# EAGLE design CTD_V02 (EAGLE 9.4.0)

## Sheet 1 of 4
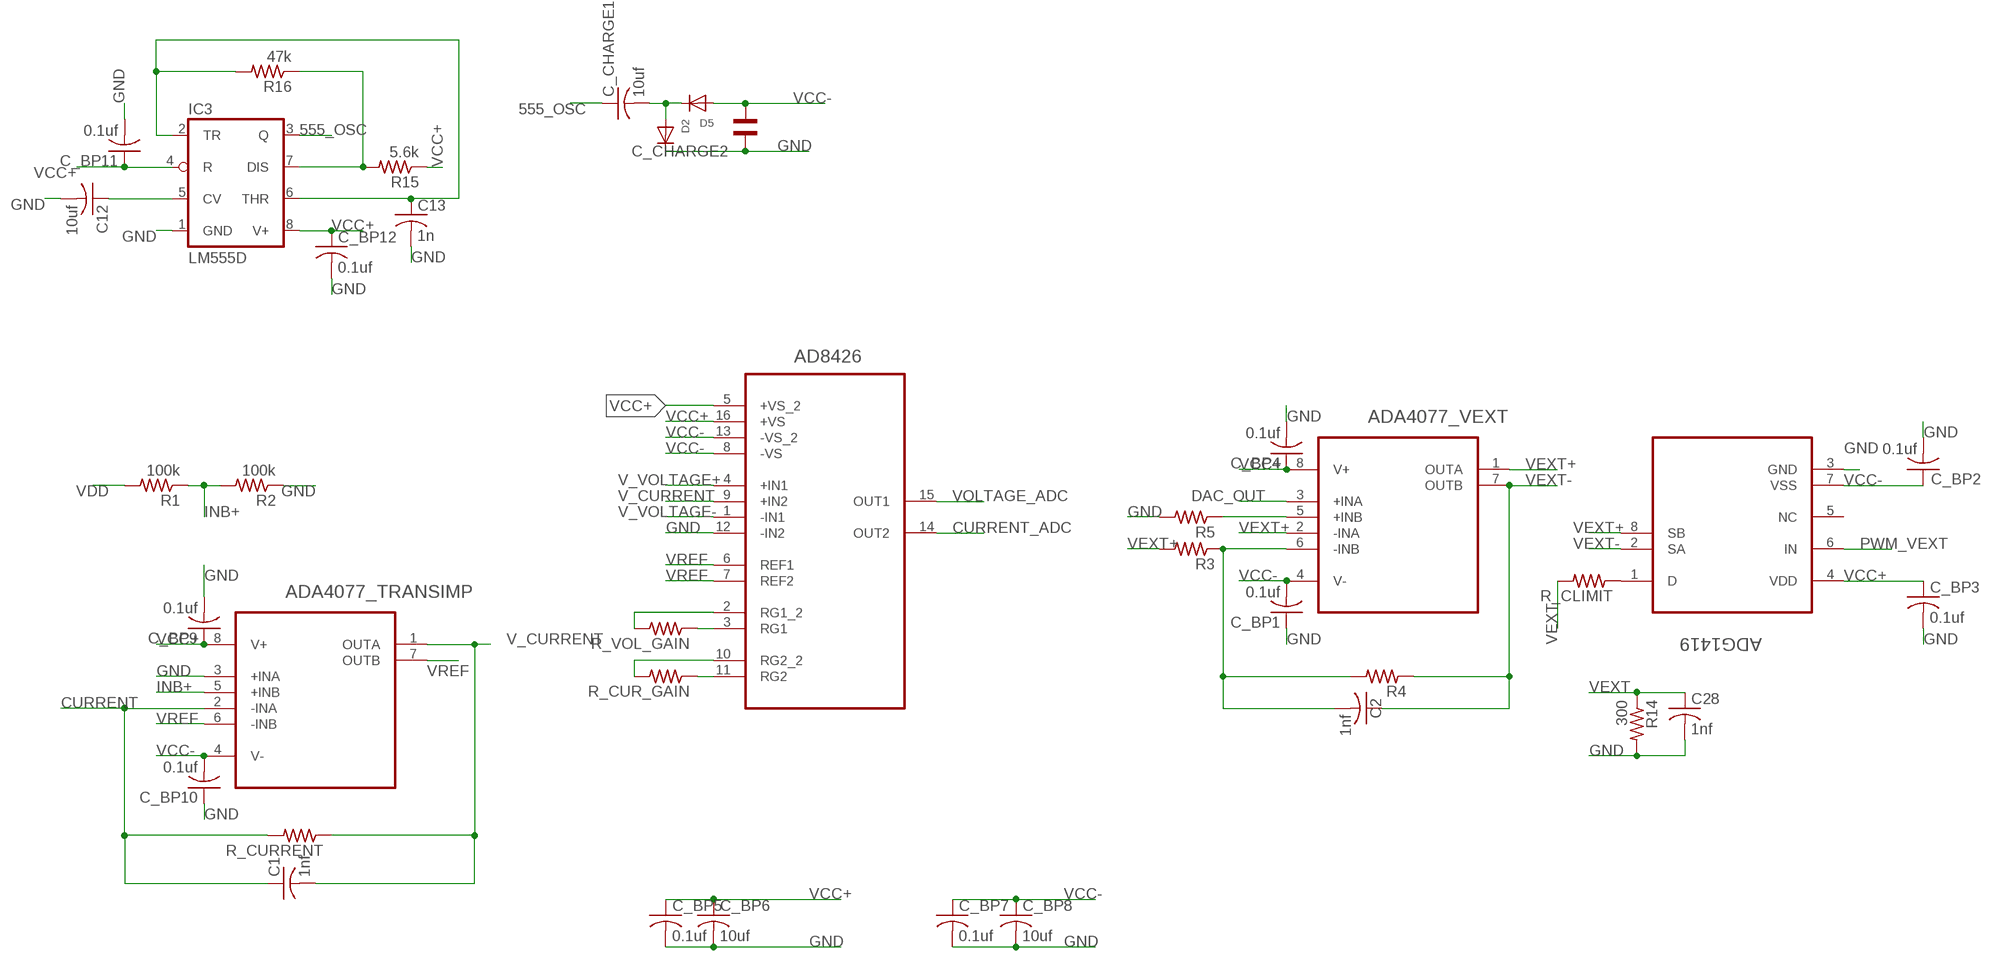
[diagram p0: schematic, sheet 1]

### Parts
AD8426  AD8426BCPZ-WP  [QFN65P400X400X100-16N]
ADA4077_TRANSIMP  ADA4075-2ARZ  [SOIC127P600X175-8N]
ADA4077_VEXT  ADA4075-2ARZ  [SOIC127P600X175-8N]
ADG1419  ADG1419BRMZ  [SOP65P490X110-8N]
C1  1nf  C-USC0603  [C0603]
C2  1nf  C-USC0603  [C0603]
C12  10uf  C-USC0603  [C0603]
C13  1n  C-USC0603  [C0603]
C28  1nf  C-USC0603  [C0603]
C_BP1  0.1uf  C-USC0603  [C0603]
C_BP2  0.1uf  C-USC0603  [C0603]
C_BP3  0.1uf  C-USC0603  [C0603]
C_BP4  0.1uf  C-USC0603  [C0603]
C_BP5  0.1uf  C-USC0603  [C0603]
C_BP6  10uf  C-USC0603  [C0603]
C_BP7  0.1uf  C-USC0603  [C0603]
C_BP8  10uf  C-USC0603  [C0603]
C_BP9  0.1uf  C-USC0603  [C0603]
C_BP10  0.1uf  C-USC0603  [C0603]
C_BP11  0.1uf  C-USC0603  [C0603]
C_BP12  0.1uf  C-USC0603  [C0603]
C_CHARGE1  10uf  C-USC0603  [C0603]
C_CHARGE2  WCAP-CSGP_1206_885012008001  [WCAP-CSGP_1206]
D2  DIODESOD-123  [SOD-123]
D5  DIODESOD-123  [SOD-123]
IC3  LM555D  [SO08]
R1  100k  R-US_R0603  [R0603]
R2  100k  R-US_R0603  [R0603]
R3  R-US_R0603  [R0603]
R4  R-US_R0603  [R0603]
R5  R-US_R0603  [R0603]
R14  300  R-US_R0603  [R0603]
R15  5.6k  R-US_R0603  [R0603]
R16  47k  R-US_R0603  [R0603]
R_CLIMIT  R-US_R0603  [R0603]
R_CUR_GAIN  R-US_R0603  [R0603]
R_CURRENT  R-US_R0603  [R0603]
R_VOL_GAIN  R-US_R0603  [R0603]

### Nets
555_OSC: C_CHARGE1.1 IC3.3(Q)
CURRENT: ADA4077_TRANSIMP.2(-INA) C1.1 R_CURRENT.2 ; also sheet 2
CURRENT_ADC: AD8426.14(OUT2) ; also sheet 2
DAC_OUT: ADA4077_VEXT.3(+INA) ; also sheet 2
GND: AD8426.12(-IN2) ADA4077_TRANSIMP.3(+INA) ADG1419.3(GND) C12.2 C13.2 C28.2 C_BP1.1 C_BP2.2 C_BP3.2 C_BP4.2 C_BP5.2 C_BP6.2 C_BP7.2 C_BP8.2 C_BP9.2 C_BP10.1 C_BP11.2 C_BP12.2 C_CHARGE2.2 D2.C IC3.1(GND) R2.1 R5.2 R14.2 ; also sheet 2,3,4
INB+: ADA4077_TRANSIMP.5(+INB) R1.1 R2.2
N$2: AD8426.2(RG1_2) R_VOL_GAIN.2
N$3: AD8426.3(RG1) R_VOL_GAIN.1
N$4: AD8426.10(RG2_2) R_CUR_GAIN.2
N$5: ADA4077_VEXT.5(+INB) R5.1
N$6: AD8426.11(RG2) R_CUR_GAIN.1
N$7: ADA4077_VEXT.6(-INB) C2.2 R3.1 R4.2
N$9: IC3.7(DIS) R15.2 R16.1
N$11: C12.1 IC3.5(CV)
N$16: ADG1419.1(D) R_CLIMIT.1
N$17: C_CHARGE1.2 D2.A D5.C
N$18: C13.1 IC3.2(TR) IC3.6(THR) R16.2
PWM_VEXT: ADG1419.6(IN) ; also sheet 2
V_CURRENT: AD8426.9(+IN2) ADA4077_TRANSIMP.1(OUTA) C1.2 R_CURRENT.1
V_VOLTAGE+: AD8426.4(+IN1) ; also sheet 2
V_VOLTAGE-: AD8426.1(-IN1) ; also sheet 2
VCC+: AD8426.5(+VS_2) AD8426.16(+VS) ADA4077_TRANSIMP.8(V+) ADA4077_VEXT.8(V+) ADG1419.4(VDD) C_BP3.1 C_BP4.1 C_BP5.1 C_BP6.1 C_BP9.1 C_BP11.1 C_BP12.1 IC3.4(R) IC3.8(V+) R15.1 ; also sheet 2,3,4
VCC-: AD8426.8(-VS) AD8426.13(-VS_2) ADA4077_TRANSIMP.4(V-) ADA4077_VEXT.4(V-) ADG1419.7(VSS) C_BP1.2 C_BP2.1 C_BP7.1 C_BP8.1 C_BP10.2 C_CHARGE2.1 D5.A
VDD: R1.2 ; also sheet 2,3,4
VEXT: C28.1 R14.1 R_CLIMIT.2 ; also sheet 2
VEXT+: ADA4077_VEXT.1(OUTA) ADA4077_VEXT.2(-INA) ADG1419.8(SB) R3.2
VEXT-: ADA4077_VEXT.7(OUTB) ADG1419.2(SA) C2.1 R4.1
VOLTAGE_ADC: AD8426.15(OUT1) ; also sheet 2
VREF: AD8426.6(REF1) AD8426.7(REF2) ADA4077_TRANSIMP.6(-INB) ADA4077_TRANSIMP.7(OUTB)
Unconnected: ADG1419.5(NC)

## Sheet 2 of 4
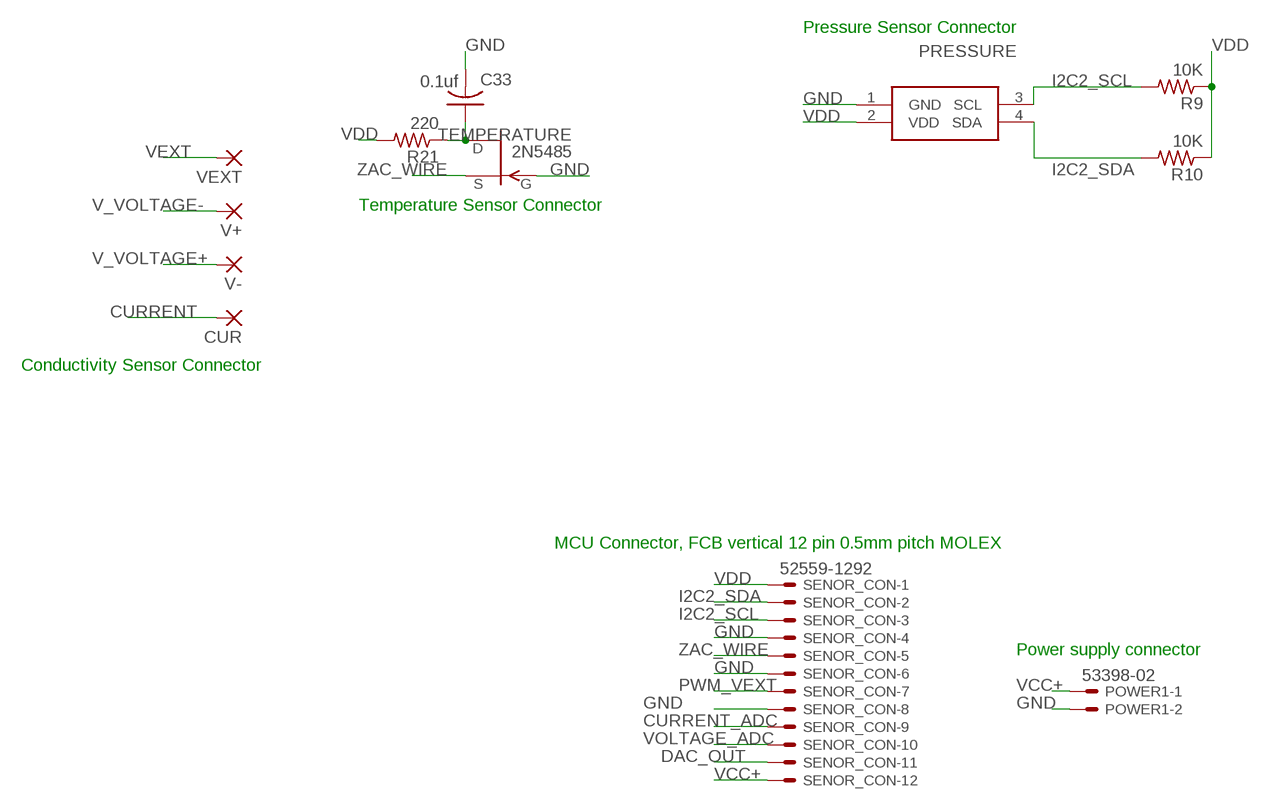
[diagram p1: schematic, sheet 2]

### Parts
C33  0.1uf  C-USC0603  [C0603]
CUR  SMD2  [SMD1,27-2,54]
POWER1  53398-02  [53398-02]
PRESSURE  MS583702BA01-50  [MS583702BA0150]
R9  10K  R-US_R0603  [R0603]
R10  10K  R-US_R0603  [R0603]
R21  220  R-US_R0603  [R0603]
SENOR_CON  52559-1292  [52559-1292]
TEMPERATURE  2N5485  [TO92-]
V+  SMD2  [SMD1,27-2,54]
V-  SMD2  [SMD1,27-2,54]
VEXT  SMD2  [SMD1,27-2,54]

### Nets
CURRENT: CUR.1(P) ; also sheet 1
CURRENT_ADC: SENOR_CON.9 ; also sheet 1
DAC_OUT: SENOR_CON.11 ; also sheet 1
GND: C33.2 POWER1.2 PRESSURE.1(GND) SENOR_CON.4 SENOR_CON.6 SENOR_CON.8 TEMPERATURE.1(G) ; also sheet 1,3,4
I2C2_SCL: PRESSURE.3(SCL) R9.2 SENOR_CON.3
I2C2_SDA: PRESSURE.4(SDA) R10.2 SENOR_CON.2
N$8: C33.1 R21.1 TEMPERATURE.3(D)
PWM_VEXT: SENOR_CON.7 ; also sheet 1
V_VOLTAGE+: V-.1(P) ; also sheet 1
V_VOLTAGE-: V+.1(P) ; also sheet 1
VCC+: POWER1.1 SENOR_CON.12 ; also sheet 1,3,4
VDD: PRESSURE.2(VDD) R9.1 R10.1 R21.2 SENOR_CON.1 ; also sheet 1,3,4
VEXT: VEXT.1(P) ; also sheet 1
VOLTAGE_ADC: SENOR_CON.10 ; also sheet 1
ZAC_WIRE: SENOR_CON.5 TEMPERATURE.2(S)

### Notes on the sheet
- Pressure Sensor Connector
- Temperature Sensor Connector
- Conductivity Sensor Connector
- MCU Connector, FCB vertical 12 pin 0.5mm pitch MOLEX
- Power supply connector

## Sheet 3 of 4
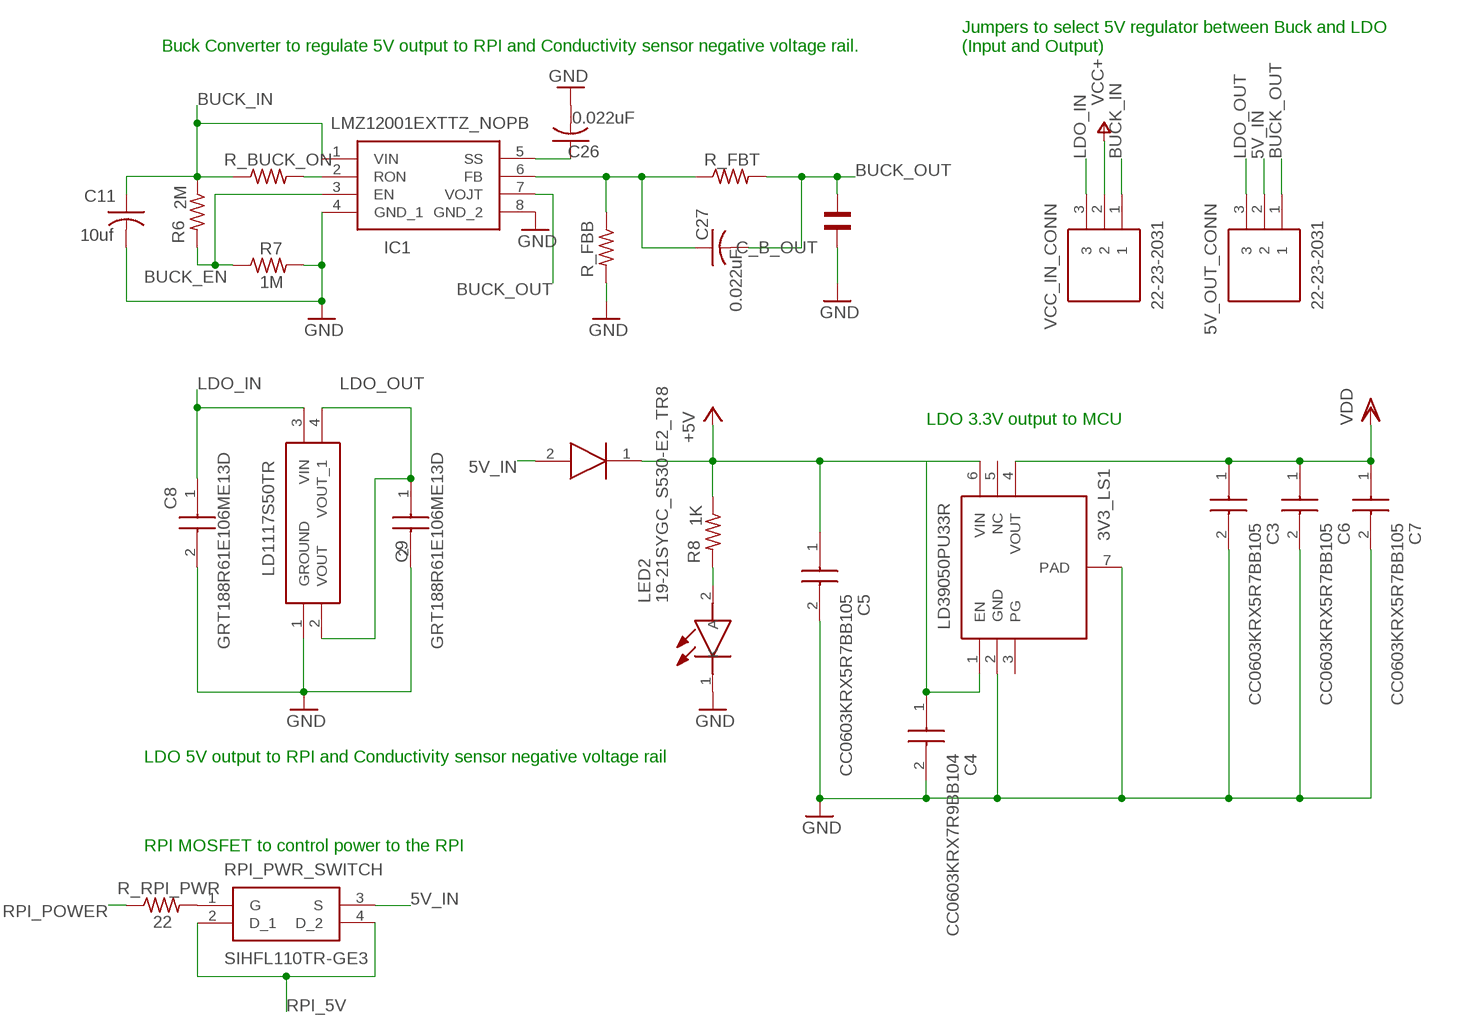
[diagram p2: schematic, sheet 3]

### Parts
3V3_LS1  LD39050PU33R  [SON95P300X300X100-7N]
5V_LS1  LD1117S50TR  [SOT230P700X190-4N]
5V_OUT_CONN  22-23-2031  [SHDR3W87P0X254_1X3_747X635X843]
C3  CC0603KRX5R7BB105  [CAPC1608X90N]
C4  CC0603KRX7R9BB104  [CAPC1608X90N]
C5  CC0603KRX5R7BB105  [CAPC1608X90N]
C6  CC0603KRX5R7BB105  [CAPC1608X90N]
C7  CC0603KRX5R7BB105  [CAPC1608X90N]
C8  GRT188R61E106ME13D  [CAPC1608X100N]
C9  GRT188R61E106ME13D  [CAPC1608X100N]
C11  10uf  C-USC0603  [C0603]
C26  0.022uF  C-USC0603  [C0603]
C27  0.022uF  C-USC0603  [C0603]
C_B_OUT  WCAP-CSGP_1206_885012008001  [WCAP-CSGP_1206]
D3  STPS2L30A  [DIOM5126X265N]
IC1  LMZ12001EXTTZ_NOPB  [NDW0007A]
LED2  19-21SYGC_S530-E2_TR8  [LEDC1608X90N]
R6  2M  R-US_R0603  [R0603]
R7  1M  R-US_R0603  [R0603]
R8  1K  R-US_R0603  [R0603]
R_BUCK_ON  R-US_R0603  [R0603]
R_FBB  R-US_R0603  [R0603]
R_FBT  R-US_R0603  [R0603]
R_RPI_PWR  22  R-US_R0603  [R0603]
RPI_PWR_SWITCH  SIHFL110TR-GE3  [SOT230P700X180-4N]
VCC_IN_CONN  22-23-2031  [SHDR3W87P0X254_1X3_747X635X843]

### Nets
5V_IN: 5V_OUT_CONN.2 D3.2(A) RPI_PWR_SWITCH.3(S) ; also sheet 4
+5V: 3V3_LS1.1(EN) 3V3_LS1.6(VIN) C4.1 C5.1 D3.1(K) R8.1
BUCK_EN: IC1.3(EN) R6.2 R7.1
BUCK_IN: C11.1 IC1.1(VIN) R6.1 R_BUCK_ON.1 VCC_IN_CONN.1
BUCK_OUT: 5V_OUT_CONN.1 C27.2 C_B_OUT.1 IC1.7(VOJT) R_FBT.2
GND: 3V3_LS1.2(GND) 3V3_LS1.7(PAD) 5V_LS1.1(GROUND) C3.2 C4.2 C5.2 C6.2 C7.2 C8.2 C9.2 C11.2 C26.2 C_B_OUT.2 IC1.4(GND_1) IC1.8(GND_2) LED2.1(K) R7.2 R_FBB.2 ; also sheet 1,2,4
LDO_IN: 5V_LS1.3(VIN) C8.1 VCC_IN_CONN.3
LDO_OUT: 5V_LS1.2(VOUT) 5V_LS1.4(VOUT_1) 5V_OUT_CONN.3 C9.1
N$1: C27.1 IC1.6(FB) R_FBB.1 R_FBT.1
N$10: C26.1 IC1.5(SS)
N$22: IC1.2(RON) R_BUCK_ON.2
N$23: LED2.2(A) R8.2
N$24: R_RPI_PWR.2 RPI_PWR_SWITCH.1(G)
RPI_5V: RPI_PWR_SWITCH.2(D_1) RPI_PWR_SWITCH.4(D_2) ; also sheet 4
RPI_POWER: R_RPI_PWR.1 ; also sheet 4
VCC+: VCC_IN_CONN.2 ; supply symbol labelled V+ ; also sheet 1,2,4
VDD: 3V3_LS1.4(VOUT) C3.1 C6.1 C7.1 ; also sheet 1,2,4
Unconnected: 3V3_LS1.3(PG) 3V3_LS1.5(NC)

### Notes on the sheet
- Buck Converter to regulate 5V output to RPI and Conductivity sensor negative voltage rail.
- Jumpers to select 5V regulator between Buck and LDO
  (Input and Output)
- LDO 3.3V output to MCU
- LDO 5V output to RPI and Conductivity sensor negative voltage rail
- RPI MOSFET to control power to the RPI

## Sheet 4 of 4
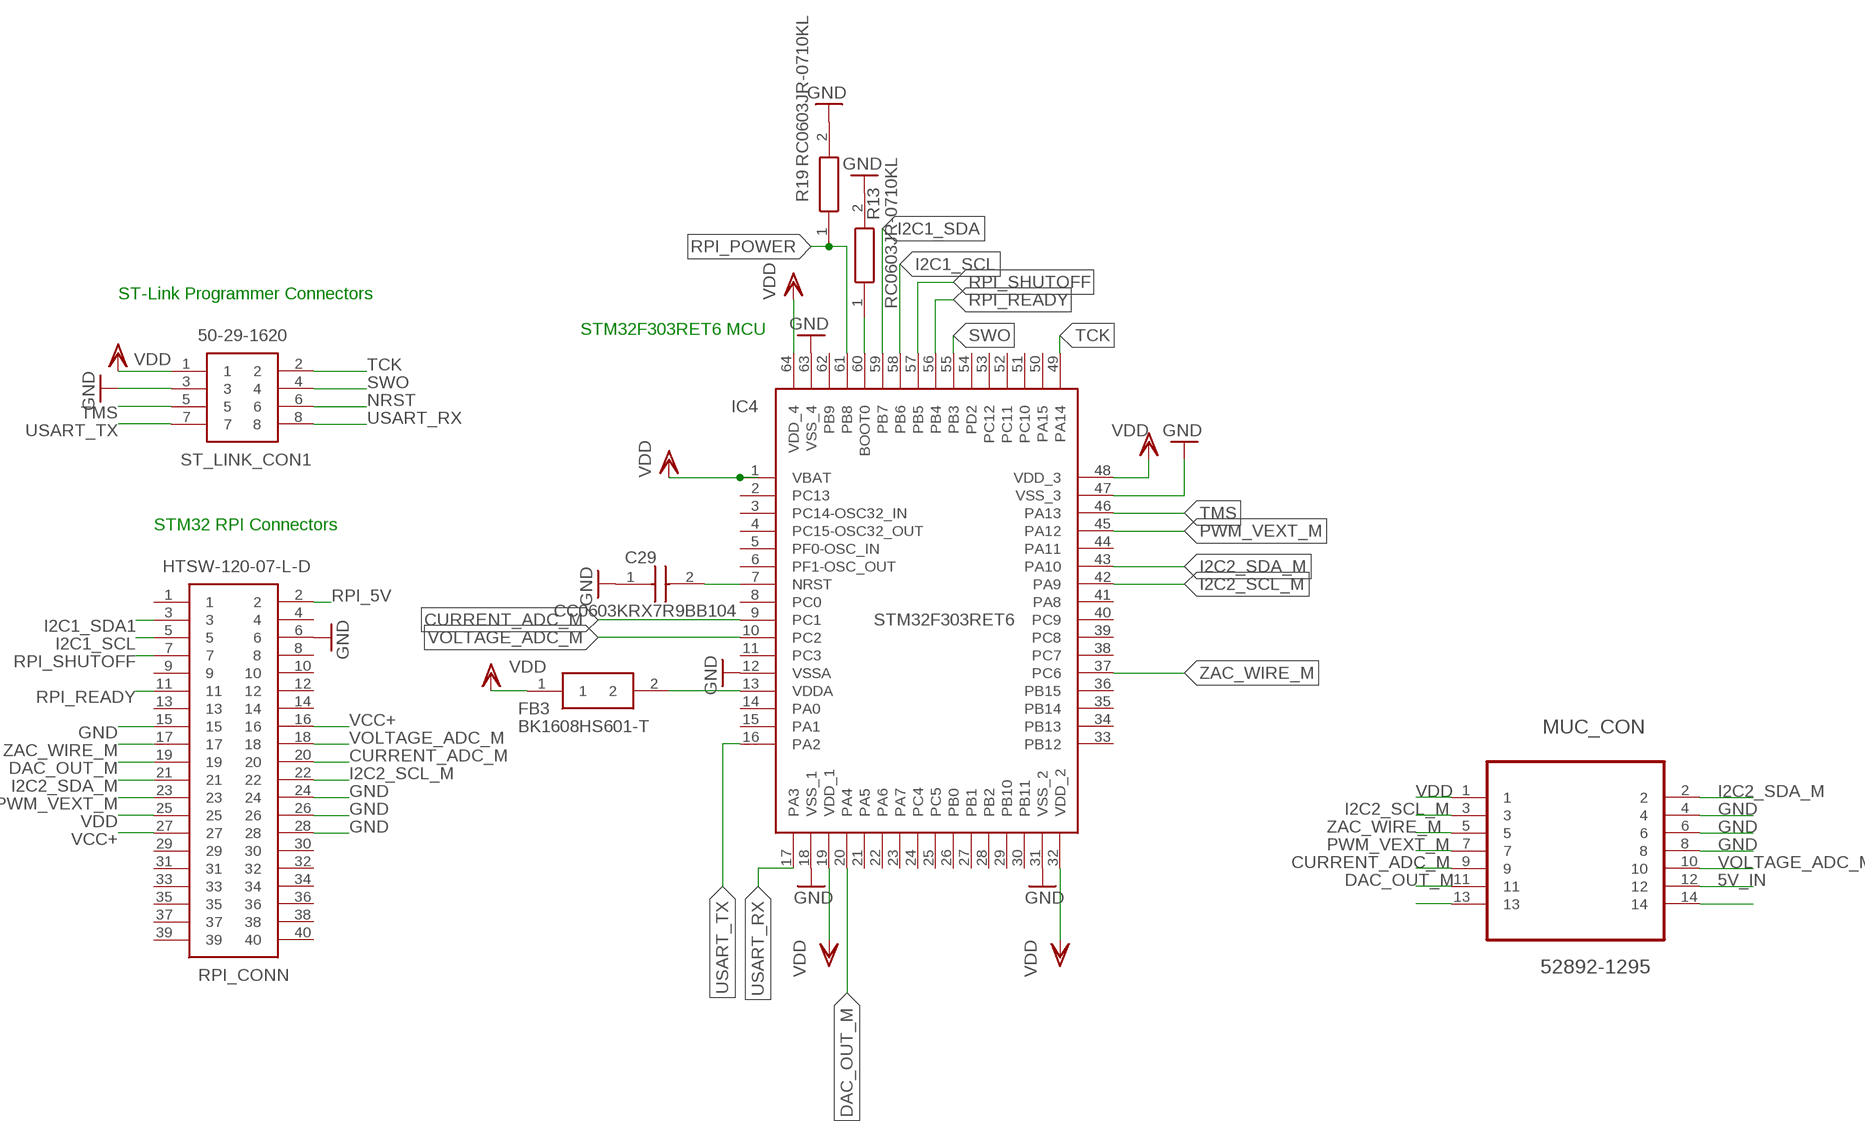
[diagram p3: schematic, sheet 4]

### Parts
C29  CC0603KRX7R9BB104  [CAPC1608X90N]
FB3  BK1608HS601-T  [BEADC1608X95N]
IC4  STM32F303RET6  [QFP50P1200X1200X160-64N]
MUC_CON  52892-1295  [MOLEX_52892-1295]
R13  RC0603JR-0710KL  [RESC1608X55N]
R19  RC0603JR-0710KL  [RESC1608X55N]
RPI_CONN  HTSW-120-07-L-D  [SAMTEC_HTSW-120-07-L]
ST_LINK_CON1  50-29-1620  [50291620]

### Nets
5V_IN: MUC_CON.12 ; also sheet 3
CURRENT_ADC_M: IC4.9(PC1) MUC_CON.9 RPI_CONN.20
DAC_OUT_M: IC4.20(PA4) MUC_CON.11 RPI_CONN.19
GND: C29.1 IC4.12(VSSA) IC4.18(VSS_1) IC4.31(VSS_2) IC4.47(VSS_3) IC4.63(VSS_4) MUC_CON.4 MUC_CON.6 MUC_CON.8 R13.2 R19.2 RPI_CONN.6 RPI_CONN.15 RPI_CONN.24 RPI_CONN.26 RPI_CONN.28 ST_LINK_CON1.3 ; also sheet 1,2,3
I2C1_SCL: IC4.58(PB6) RPI_CONN.5
I2C1_SDA: IC4.59(PB7)
I2C1_SDA1: RPI_CONN.3
I2C2_SCL_M: IC4.42(PA9) MUC_CON.3 RPI_CONN.22
I2C2_SDA_M: IC4.43(PA10) MUC_CON.2 RPI_CONN.21
N$21: MUC_CON.13
N$25: IC4.60(BOOT0) R13.1
N$27: FB3.2 IC4.13(VDDA)
N$33: MUC_CON.14
NRST: C29.2 IC4.7(NRST) ST_LINK_CON1.6
PWM_VEXT_M: IC4.45(PA12) MUC_CON.7 RPI_CONN.23
RPI_5V: RPI_CONN.2 ; also sheet 3
RPI_POWER: IC4.61(PB8) R19.1 ; also sheet 3
RPI_READY: IC4.56(PB4) RPI_CONN.11
RPI_SHUTOFF: IC4.57(PB5) RPI_CONN.7
SWO: IC4.55(PB3) ST_LINK_CON1.4
TCK: IC4.49(PA14) ST_LINK_CON1.2
TMS: IC4.46(PA13) ST_LINK_CON1.5
USART_RX: IC4.17(PA3) ST_LINK_CON1.8
USART_TX: IC4.16(PA2) ST_LINK_CON1.7
VCC+: RPI_CONN.16 RPI_CONN.27 ; also sheet 1,2,3
VDD: FB3.1 IC4.1(VBAT) IC4.19(VDD_1) IC4.32(VDD_2) IC4.48(VDD_3) IC4.64(VDD_4) MUC_CON.1 RPI_CONN.25 ST_LINK_CON1.1 ; also sheet 1,2,3
VOLTAGE_ADC_M: IC4.10(PC2) MUC_CON.10 RPI_CONN.18
ZAC_WIRE_M: IC4.37(PC6) MUC_CON.5 RPI_CONN.17
Unconnected: IC4.2(PC13) IC4.3(PC14-OSC32_IN) IC4.4(PC15-OSC32_OUT) IC4.5(PF0-OSC_IN) IC4.6(PF1-OSC_OUT) IC4.8(PC0) IC4.11(PC3) IC4.14(PA0) IC4.15(PA1) IC4.21(PA5) IC4.22(PA6) IC4.23(PA7) IC4.24(PC4) IC4.25(PC5) IC4.26(PB0) IC4.27(PB1) IC4.28(PB2) IC4.29(PB10) IC4.30(PB11) IC4.33(PB12) IC4.34(PB13) IC4.35(PB14) IC4.36(PB15) IC4.38(PC7) IC4.39(PC8) IC4.40(PC9) IC4.41(PA8) IC4.44(PA11) IC4.50(PA15) IC4.51(PC10) IC4.52(PC11) IC4.53(PC12) IC4.54(PD2) IC4.62(PB9) RPI_CONN.1 RPI_CONN.4 RPI_CONN.8 RPI_CONN.9 RPI_CONN.10 RPI_CONN.12 RPI_CONN.13 RPI_CONN.14 RPI_CONN.29 RPI_CONN.30 RPI_CONN.31 RPI_CONN.32 RPI_CONN.33 RPI_CONN.34 RPI_CONN.35 RPI_CONN.36 RPI_CONN.37 RPI_CONN.38 RPI_CONN.39 RPI_CONN.40

### Notes on the sheet
- ST-Link Programmer Connectors
- STM32F303RET6 MCU
- STM32 RPI Connectors

## Library data of the parts
3V3_LS1 = SamacSys_Parts:LD39050PU33R: STMICROELECTRONICS - LD39050PU33R - LDO, FIXED, 3.3V, 0.5A, DFN-6 Source: Datasheet <https://componentsearchengine.com/Datasheets/1/LD39050PU33R.pdf>; DESCRIPTION: STMICROELECTRONICS - LD39050PU33R - LDO, FIXED, 3.3V, 0.5A, DFN-6; HEIGHT: 1mm; MANUFACTURER_NAME: STMicroelectronics; MANUFACTURER_PART_NUMBER: LD39050PU33R; MOUSER_PART_NUMBER: 511-LD39050PU33R; MOUSER_PRICE-STOCK: https://www.mouser.com/Search/Refine.aspx?Keyword=511-LD39050PU33R
5V_LS1 = SamacSys_Parts:LD1117S50TR: LD1117S50TR, Low Dropout Voltage Regulator, 1.3A, 5 V +/-1%, 4-Pin SOT-223 Source: Datasheet <https://componentsearchengine.com/Datasheets/1/LD1117S50TR.pdf>; DESCRIPTION: LD1117S50TR, Low Dropout Voltage Regulator, 1.3A, 5 V +/-1%, 4-Pin SOT-223; HEIGHT: 1.9mm; MANUFACTURER_NAME: STMicroelectronics; MANUFACTURER_PART_NUMBER: LD1117S50TR; MOUSER_PART_NUMBER: 511-LD1117S50; MOUSER_PRICE-STOCK: https://www.mouser.com/Search/Refine.aspx?Keyword=511-LD1117S50
5V_OUT_CONN VCC_IN_CONN = SamacSys_Parts:22-23-2031: 2.54mm,header,KK,vert,Sn,frictn lock,3w Molex KK 254 Series, Series Number 6373, 2.54mm Pitch 3 Way 1 Row Straight PCB Header, Through Hole, Solder Termination Source: Datasheet <https://componentsearchengine.com/Datasheets/1/22-23-2031.pdf>; DESCRIPTION: 2.54mm,header,KK,vert,Sn,frictn lock,3w Molex KK 254 Series, Series Number 6373, 2.54mm Pitch 3 Way 1 Row Straight PCB Header, Through Hole, Solder Termination; HEIGHT: 8.43mm; MANUFACTURER_NAME: Molex; MANUFACTURER_PART_NUMBER: 22-23-2031; MOUSER_PART_NUMBER: 538-22-23-2031; MOUSER_PRICE-STOCK: https://www.mouser.com/Search/Refine.aspx?Keyword=538-22-23-2031
AD8426 = AD8426BCPZ-WP:AD8426BCPZ-WP: Wide Supply Range, Rail-to-Rail Output Instrumentation Amplifier; AVAILABILITY: Unavailable; DESCRIPTION: Linear IC - In-amp Analog Devices AD8426BCPZ-WP InAmp LFCSP 16 VQ _4x4_; MF: Analog Devices; MP: AD8426BCPZ-WP; PACKAGE: LFCSP-16 Analog Devices; PRICE: None
ADA4077_TRANSIMP ADA4077_VEXT = Analog Devices_By_element14_Batch_1:ADA4075-2ARZ: Ultralow Noise Amplifier at Lower Power; MPN: ADA4077; OC_FARNELL: 1701254; OC_NEWARK: 19P8164; PACKAGE: SOIC-8; SUPPLIER: ANALOG DEVICES
ADG1419 = Analog Devices_By_element14_Batch_1:ADG1419BRMZ: SPDT Switch; MPN: ADG1419BRMZ; OC_FARNELL: 1858061; OC_NEWARK: 52R8034; PACKAGE: MSOP-8; SUPPLIER: Analog Devices
C1 C2 C11-C13 C26-C28 C33 C_BP1-C_BP12 C_CHARGE1 = adafruit:C-US: CAPACITOR, American symbol
C3 C5-C7 = SamacSys_Parts:CC0603KRX5R7BB105: YAGEO - CC0603KRX5R7BB105 - CERAMIC CAPACITOR, 1UF, 16V, X5R, 10%, 0603, FULL REEL Source: Datasheet <https://componentsearchengine.com/Datasheets/1/CC0603KRX5R7BB105.pdf>; DESCRIPTION: YAGEO - CC0603KRX5R7BB105 - CERAMIC CAPACITOR, 1UF, 16V, X5R, 10%, 0603, FULL REEL; HEIGHT: 0.9mm; MANUFACTURER_NAME: YAGEO (PHYCOMP); MANUFACTURER_PART_NUMBER: CC0603KRX5R7BB105; MOUSER_PART_NUMBER: 603-CC603KRX5R7BB105; MOUSER_PRICE-STOCK: https://www.mouser.com/Search/Refine.aspx?Keyword=603-CC603KRX5R7BB105
C4 C29 = SamacSys_Parts:CC0603KRX7R9BB104: CAPACITOR, 0603 100nF +/-10% 50V Source: Datasheet <https://componentsearchengine.com/Datasheets/1/CC0603KRX7R9BB104.pdf>; DESCRIPTION: CAPACITOR, 0603 100nF +/-10% 50V; HEIGHT: 0.9mm; MANUFACTURER_NAME: YAGEO (PHYCOMP); MANUFACTURER_PART_NUMBER: CC0603KRX7R9BB104; MOUSER_PART_NUMBER: 603-CC603KRX7R9BB104; MOUSER_PRICE-STOCK: https://www.mouser.com/Search/Refine.aspx?Keyword=603-CC603KRX7R9BB104
C8 C9 = SamacSys_Parts:GRT188R61E106ME13D: MLCC SMD 0603 10uF 25V X5R 20% Source: Datasheet <https://componentsearchengine.com/Datasheets/1/GRT188R61E106ME13D.pdf>; DESCRIPTION: MLCC SMD 0603 10uF 25V X5R 20%; HEIGHT: 1mm; MANUFACTURER_NAME: Murata Electronics; MANUFACTURER_PART_NUMBER: GRT188R61E106ME13D; MOUSER_PART_NUMBER: 81-GRT188R61E106ME3D; MOUSER_PRICE-STOCK: https://www.mouser.com/Search/Refine.aspx?Keyword=81-GRT188R61E106ME3D
C_B_OUT C_CHARGE2 = Wurth_Elektronik_Passive_Capacitors_rev18b:WCAP-CSGP_1206: WCAP-CSGP Ceramic Capacitors Characteristics Multilayer Ceramic Chip Capacitor Recommended soldering:Reflow, for 0603 and 0805 wave soldering is also allowed Operating temperature:-55 °C to +125 °C; Ceramic characteristics: Class I - NPO ; Class II -X7R, X5R High performance ceramic High capacitance stability Minimal aging Termination:Cu/Ni/Sn <http://katalog.we-online.de/media/images/eisos/WCAP-CSGP_pf2.jpg> Details see: http://katalog.we-online.de/en/pbs/WCAP-CSGP-1206? Created: 2015-01-28 2015 (C) Wurth Elektronik
CUR V+ V- VEXT = wirepad:SMD2: SMD PAD
D2 D5 = adafruit:DIODE: Diode SMADIODE - SMA Surface Mount Package 20V 1A Schottky Diode Digikey: 641-1014-6-ND DO-1N4148 - Through Hole Small Current Diode SOD-123 20V 1 A (.5mV Vf) Schottky Diode - Digikey: MBRX120TPMSCT-ND SOD-323 10V 570mA (.38mV Vf, 3ns) Schottky Diode - Digikey: ZLLS410CT-ND SOD-523 30V 30mA Schottky Diode (RB751S-40TE61) - Digikey: RB751S-40TE61CT-ND SOT23-R/W - SOT23 Package (R = Solder Paste/Reflow Ovens, W = Hand-Soldering) BAT54Film 40V 300mA - Digikey: 497-7162-1-ND
D3 = SamacSys_Parts:STPS2L30A: STPS2L30A, Schottky Diode, 2A max, 30V, 2-Pin, SMA Source: Datasheet <https://componentsearchengine.com/Datasheets/1/STPS2L30A.pdf>; DESCRIPTION: STPS2L30A, Schottky Diode, 2A max, 30V, 2-Pin, SMA; HEIGHT: 2.65mm; MANUFACTURER_NAME: STMicroelectronics; MANUFACTURER_PART_NUMBER: STPS2L30A; MOUSER_PART_NUMBER: 511-STPS2L30A; MOUSER_PRICE-STOCK: https://www.mouser.com/Search/Refine.aspx?Keyword=511-STPS2L30A
FB3 = SamacSys_Parts:BK1608HS601-T: TAIYO YUDEN - BK1608HS601-T - FERRITE BEAD, 0.45OHM, 350mA, 0603 Source: Datasheet <https://componentsearchengine.com/Datasheets/1/BK1608HS601-T.pdf>; DESCRIPTION: TAIYO YUDEN - BK1608HS601-T - FERRITE BEAD, 0.45OHM, 350mA, 0603; HEIGHT: 0.95mm; MANUFACTURER_NAME: TAIYO YUDEN; MANUFACTURER_PART_NUMBER: BK1608HS601-T; MOUSER_PART_NUMBER: 963-BK1608HS601-T; MOUSER_PRICE-STOCK: https://www.mouser.com/Search/Refine.aspx?Keyword=963-BK1608HS601-T
IC1 = SamacSys_Parts:LMZ12001EXTTZ_NOPB: 1A SIMPLE SWITCHER Power Module with 20V Maximum Input Voltage for Military and Rugged App Source: Datasheet <http://www.ti.com/lit/gpn/lmz12001ext>; DESCRIPTION: 1A SIMPLE SWITCHER Power Module with 20V Maximum Input Voltage for Military and Rugged App; HEIGHT: mm; MANUFACTURER_NAME: Texas Instruments; MANUFACTURER_PART_NUMBER: LMZ12001EXTTZ/NOPB; MOUSER_PART_NUMBER: 926-LMZ12001EXTTZNPB; MOUSER_PRICE-STOCK: https://www.mouser.com/Search/Refine.aspx?Keyword=926-LMZ12001EXTTZNPB
IC3 = adafruit:*555: TIMER Changed DIP package to have round (not oval) pin pads http://www.ladyada.net/library/pcb/eaglelibrary.html
IC4 = SamacSys_Parts:STM32F303RET6: MCU+FPU 32-Bit Cortex-M4 512KB LQFP64 Source: Datasheet <https://componentsearchengine.com/Datasheets/1/STM32F303RET6.pdf>; DESCRIPTION: MCU+FPU 32-Bit Cortex-M4 512KB LQFP64; HEIGHT: 1.6mm; MANUFACTURER_NAME: STMicroelectronics; MANUFACTURER_PART_NUMBER: STM32F303RET6; MOUSER_PART_NUMBER: 511-STM32F303RET6; MOUSER_PRICE-STOCK: https://www.mouser.com/Search/Refine.aspx?Keyword=511-STM32F303RET6
LED2 = SamacSys_Parts:19-21SYGC_S530-E2_TR8: Standard LEDs - SMD SMD LED Source: Datasheet <https://componentsearchengine.com/Datasheets/1/19-21SYGC_S530-E2_TR8.pdf>; DESCRIPTION: Standard LEDs - SMD SMD LED; HEIGHT: 0.9mm; MANUFACTURER_NAME: Everlight; MANUFACTURER_PART_NUMBER: 19-21SYGC/S530-E2/TR8; MOUSER_PART_NUMBER: 638-1921SYGCS530E2; MOUSER_PRICE-STOCK: https://www.mouser.com/Search/Refine.aspx?Keyword=638-1921SYGCS530E2
MUC_CON = Molex_By_element14_Batch_1:52892-1295: CONNECTOR, FPC, ZIF, 0.50MM, 12 WAY; MPN: 52892-1295; OC_FARNELL: 1556805; OC_NEWARK: 25M4431; PACKAGE: CONNECTOR, FPC, ZIF, 0.50MM, 12 WAY; SUPPLIER: Molex
POWER1 = con-molex:53?-02: CONNECTOR wire to board 1.25 mm (.049 inch) pitch header; MF: MOLEX; OC_FARNELL: unknown; OC_NEWARK: unknown
PRESSURE = SamacSys_Parts:MS583702BA01-50: SENSOR SOLUTIONS - TE CONNECTIVITY - MS583702BA01-50 - GEL FILLED PRESSURE SENSOR, 1.2BAR, 3V Source: Datasheet <https://componentsearchengine.com/Datasheets/1/MS583702BA01-50.pdf>; DESCRIPTION: SENSOR SOLUTIONS - TE CONNECTIVITY - MS583702BA01-50 - GEL FILLED PRESSURE SENSOR, 1.2BAR, 3V; HEIGHT: 2.75mm; MANUFACTURER_NAME: TE Connectivity; MANUFACTURER_PART_NUMBER: MS583702BA01-50; MOUSER_PART_NUMBER: 824-MS583702BA01-50; MOUSER_PRICE-STOCK: https://www.mouser.com/Search/Refine.aspx?Keyword=824-MS583702BA01-50
R1-R10 R14-R16 R21 R_BUCK_ON R_CLIMIT R_CUR_GAIN R_CURRENT R_FBB R_FBT R_RPI_PWR R_VOL_GAIN = adafruit:R-US_: RESISTOR, American symbol
R13 R19 = SamacSys_Parts:RC0603JR-0710KL: YAGEO (PHYCOMP) - RC0603JR-0710KL - RES, THICK FILM, 10K, 5%, 0.1W, 0603 Source: Datasheet <https://componentsearchengine.com/Datasheets/1/RC0603JR-0710KL.pdf>; DESCRIPTION: YAGEO (PHYCOMP) - RC0603JR-0710KL - RES, THICK FILM, 10K, 5%, 0.1W, 0603; HEIGHT: 0.55mm; MANUFACTURER_NAME: YAGEO (PHYCOMP); MANUFACTURER_PART_NUMBER: RC0603JR-0710KL; MOUSER_PART_NUMBER: 603-RC0603JR-0710KL; MOUSER_PRICE-STOCK: https://www.mouser.com/Search/Refine.aspx?Keyword=603-RC0603JR-0710KL
RPI_CONN = SamacSys_Parts:HTSW-120-07-L-D: POST HEADER , THROUGH-HOLE Source: Datasheet <https://componentsearchengine.com/Datasheets/1/HTSW-120-07-L-D.pdf>; DESCRIPTION: POST HEADER , THROUGH-HOLE; HEIGHT: mm; MANUFACTURER_NAME: SAMTEC; MANUFACTURER_PART_NUMBER: HTSW-120-07-L-D; MOUSER_PART_NUMBER: 200-HTSW12007LD; MOUSER_PRICE-STOCK: https://www.mouser.com/Search/Refine.aspx?Keyword=200-HTSW12007LD
RPI_PWR_SWITCH = SamacSys_Parts:SIHFL110TR-GE3: MOSFET 100V Vds 20V Vgs SOT-223 Source: Datasheet <https://componentsearchengine.com/Datasheets/1/SIHFL110TR-GE3.pdf>; DESCRIPTION: MOSFET 100V Vds 20V Vgs SOT-223; HEIGHT: 1.8mm; MANUFACTURER_NAME: Vishay; MANUFACTURER_PART_NUMBER: SIHFL110TR-GE3; MOUSER_PART_NUMBER: 78-SIHFL110TR-GE3; MOUSER_PRICE-STOCK: https://www.mouser.com/Search/Refine.aspx?Keyword=78-SIHFL110TR-GE3
SENOR_CON = con-molex:52559-1292: FFC/FPC-to-Board 0.50mm (.020") SMT, Vertical, ZIF Receptacle Source: http://www.molex.com/product/ffc/52559.html; MF: MOLEX; MPN: 52559-1292; OC_FARNELL: unknown; OC_NEWARK: 91C4526
ST_LINK_CON1 = SamacSys_Parts:50-29-1620: Headers & Wire Housings KK 100 Hdr Assy Bkwy Bkwy 08 Ckt 30 SGold Source: Datasheet <https://componentsearchengine.com/Datasheets/1/50-29-1620.pdf>; DESCRIPTION: Headers & Wire Housings KK 100 Hdr Assy Bkwy Bkwy 08 Ckt 30 SGold; HEIGHT: 8.53mm; MANUFACTURER_NAME: Molex; MANUFACTURER_PART_NUMBER: 50-29-1620; MOUSER_PART_NUMBER: 538-50-29-1620; MOUSER_PRICE-STOCK: https://www.mouser.com/Search/Refine.aspx?Keyword=538-50-29-1620
TEMPERATURE = transistor-fet:?548*: N-Channel JFETs Source: VISHAY 2N5484.pdf Compatible: TO92 2N5245 J304 J305 U310 J308 J309 J310 TO72 2N4416 2N4416A 2N3823 2N4351 3N169 3N170 3N171 MFE3002 TO18 2N3796 2N3797 MFE825 Source: Motorola European Master Guide Pacge 3-59

## Board
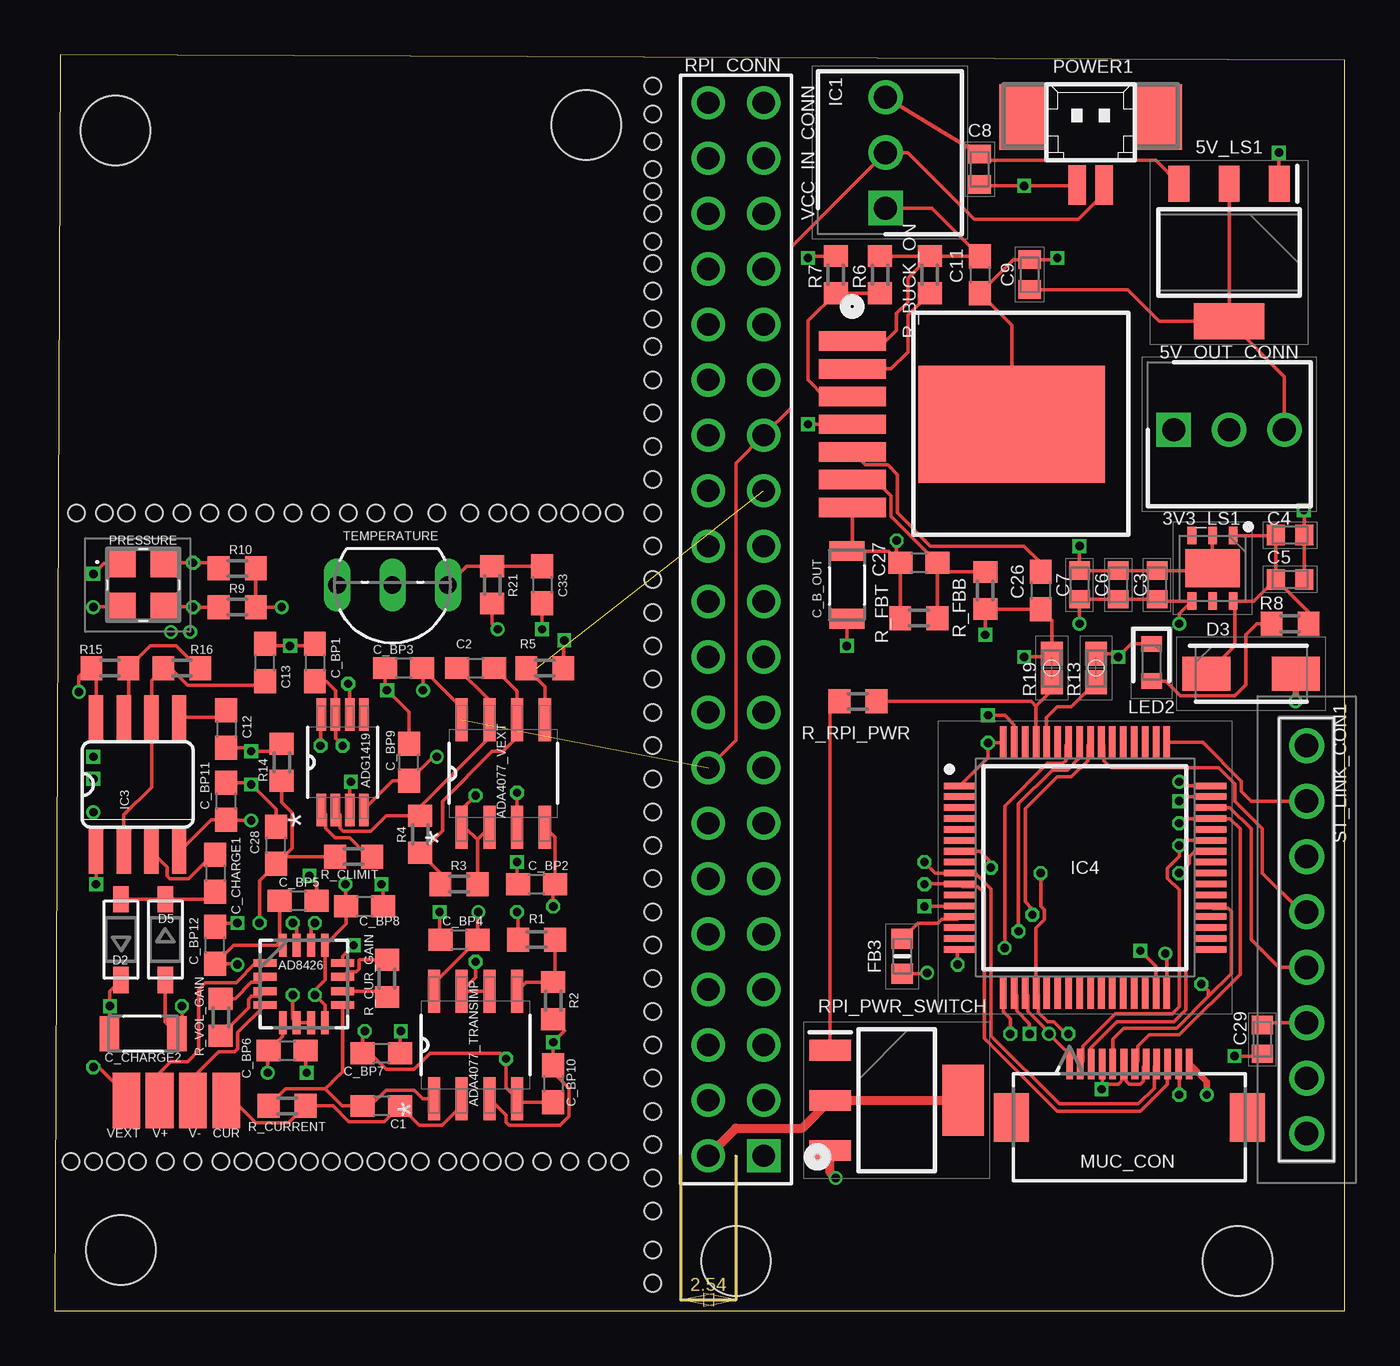
[diagram p4: board, top side]
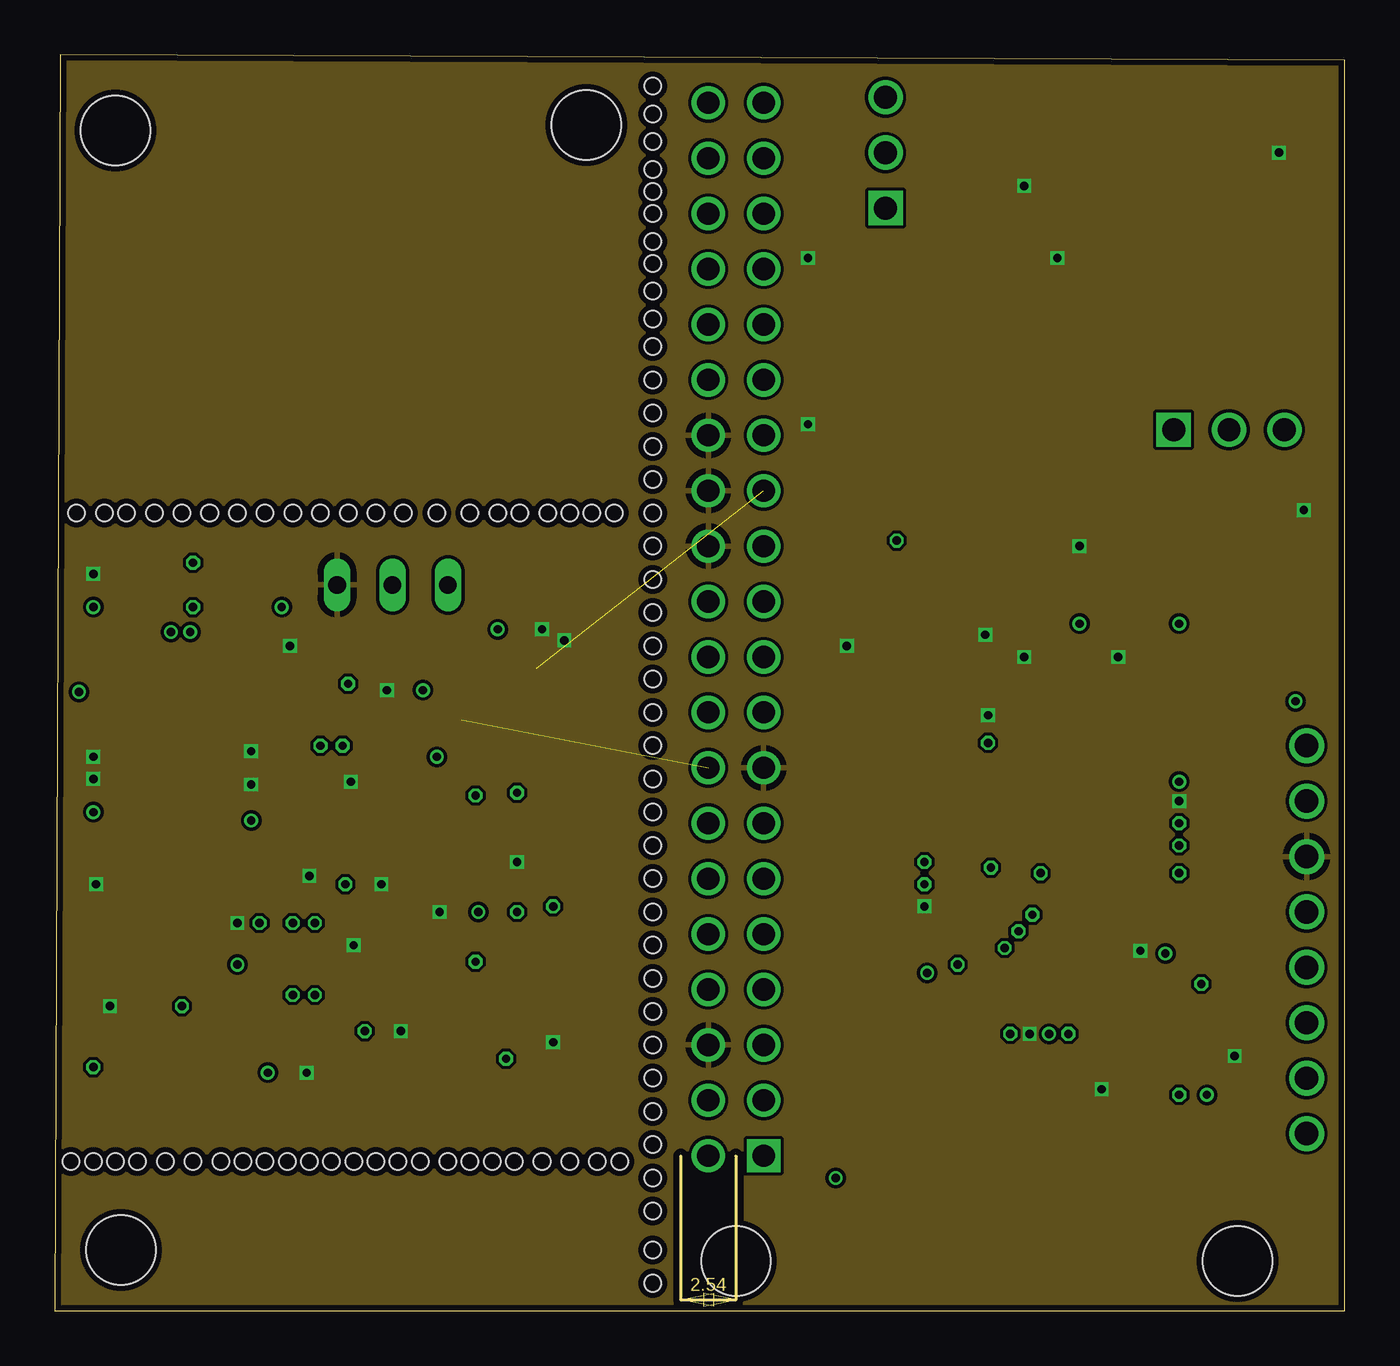
[diagram p5: board, inner layer GND]
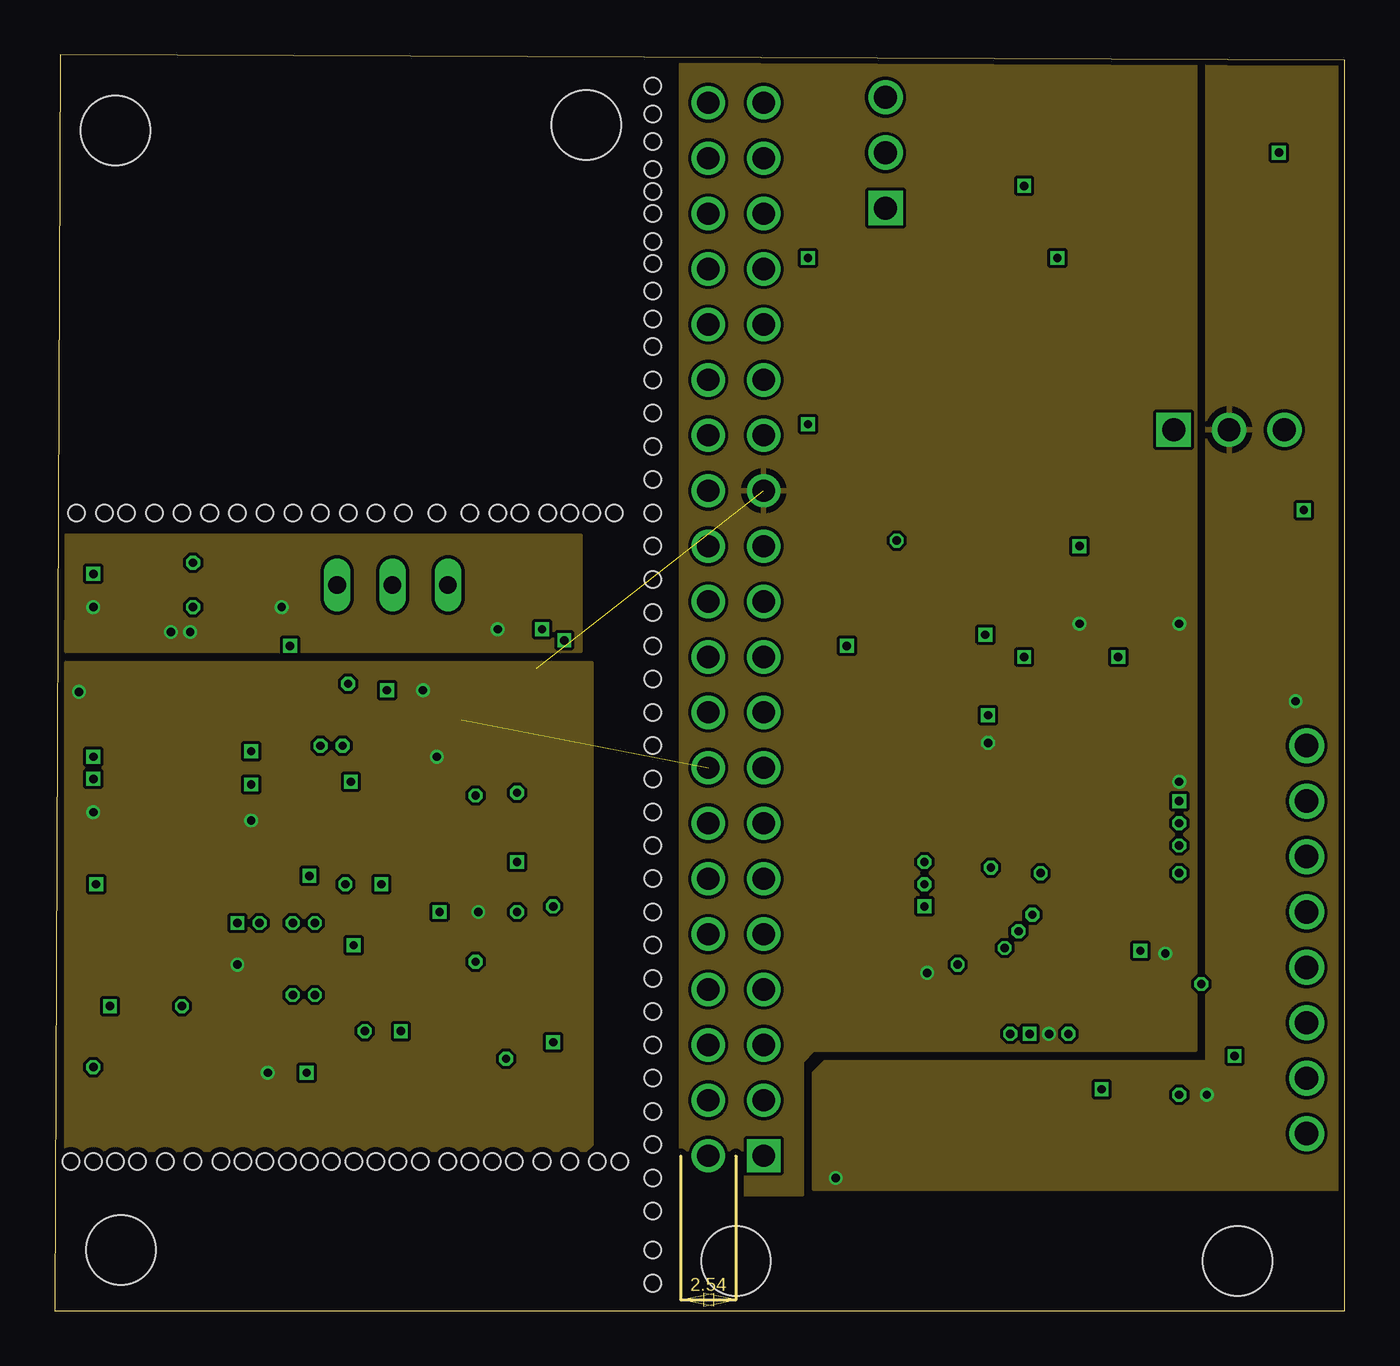
[diagram p6: board, inner layer Power]
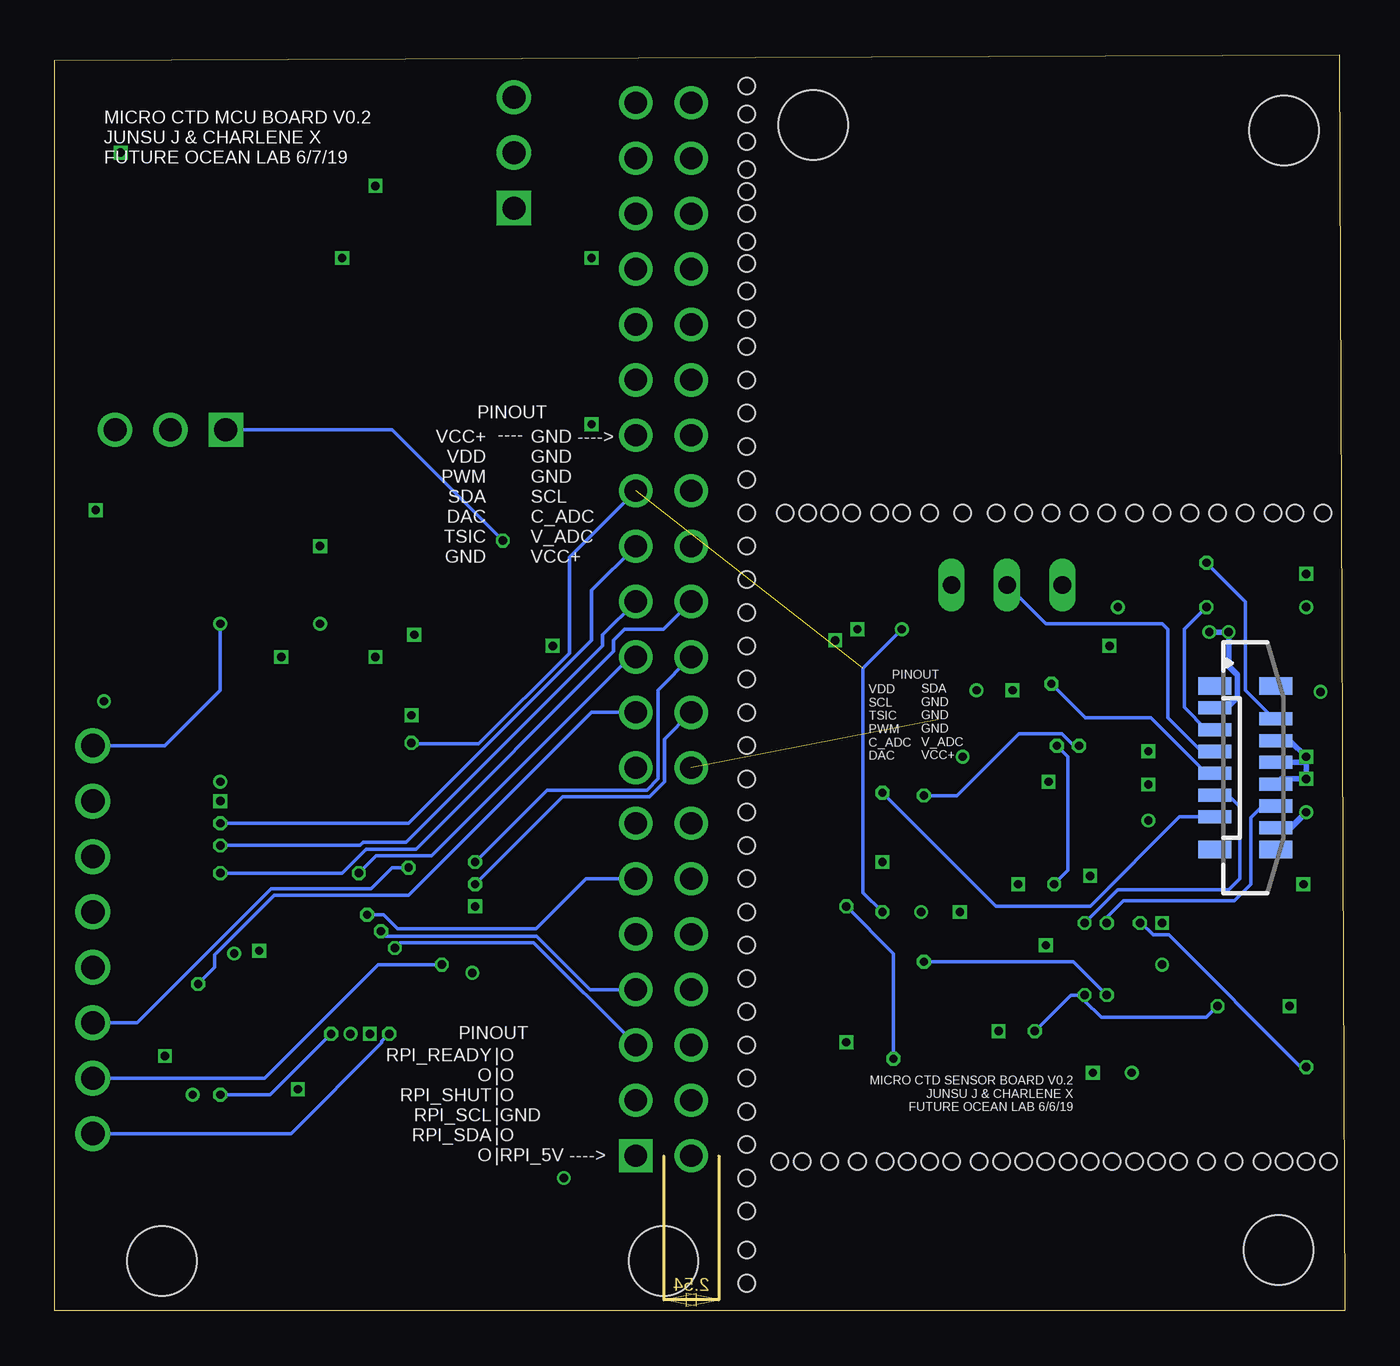
[diagram p7: board, bottom side, seen from below]

Size 59.16 x 57.58 mm. Coordinates in mm from the lower left corner, seen from the top.
Outline: 0,0 59.16,0 59.16,57.33 0.25,57.58 0,0
Copper layers (1+2*3+16): Top 0.0356mm / dielectric 0.2489mm / GND 0.0356mm / dielectric 39mil / Route3 0.035mm / dielectric 0.2489mm / Bottom 0.0356mm
Design rules "advanced_circuits_4layer": minimum track width 6mil, minimum drill 15mil, track to track 6mil, track to pad 6mil, pad to pad 6mil, via to via 6mil, smd to smd 6mil, copper to edge 11mil, drill to drill 6mil, minimum pad ring 7mil, minimum via ring 5mil, stop-mask expansion 4mil, vias tented up to drill 0mil, thermal gap 11mil
Holes 3.17 mm at 2.79,54.1 54.24,2.29 31.24,2.29 24.38,54.36 3.05,2.79
Holes 0.75 mm at 27.43,1.27 27.43,2.79 27.43,4.57 27.43,6.1 27.43,7.62 27.43,9.14 27.43,10.67 27.43,12.19 27.43,13.72 27.43,15.24 27.43,16.76 27.43,18.29 27.43,19.81 27.43,21.34 27.43,22.86 27.43,24.38 27.43,25.91 27.43,27.43 27.43,28.96 27.43,30.48 27.43,32 27.43,33.53 27.43,35.05 27.43,36.58 27.43,38.1 27.43,39.62 27.43,41.15 27.43,42.67 27.43,44.2 27.43,45.47 27.43,46.74 27.43,48.01 27.43,49.02 27.43,50.29 27.43,51.31 27.43,52.32 27.43,53.59 27.43,54.86 27.43,56.13 0.76,6.86 1.78,6.86 2.79,6.86 3.81,6.86 5.08,6.86 6.35,6.86 7.62,6.86 8.64,6.86 9.65,6.86 10.67,6.86 11.68,6.86 12.7,6.86 13.72,6.86 14.73,6.86 15.75,6.86 16.76,6.86 18.03,6.86 19.05,6.86 20.07,6.86 21.08,6.86 22.35,6.86 23.62,6.86 24.89,6.86 25.91,6.86 1.02,36.58 2.29,36.58 3.3,36.58 4.57,36.58 5.84,36.58 7.11,36.58 8.38,36.58 9.65,36.58 10.92,36.58 12.19,36.58 13.46,36.58 14.73,36.58 16,36.58 17.53,36.58 19.05,36.58 20.32,36.58 21.34,36.58 22.61,36.58 23.62,36.58 24.64,36.58 25.65,36.58

### Footprints (pad centres in the part's own frame; a part is rotated, then mirrored left to right if it is on the bottom)
SON95P300X300X100-7N = smd 0.8 x 0.4: 1 -1.5,0.95; 2 -1.5,0; 3 -1.5,-0.95; 4 1.5,-0.95; 5 1.5,0; 6 1.5,0.95 | smd 1.75 x 2.5: 7 0,0
SOT230P700X190-4N = smd 1.65 x 0.95: 1 -3.15,2.3; 2 -3.15,0; 3 -3.15,-2.3 | smd 1.65 x 3.25: 4 3.15,0
SHDR3W87P0X254_1X3_747X635X843 = drill 1.05 pad 1.575 square: 1 0,0 | drill 1.05 pad 1.575: 2 -2.54,0; 3 -5.08,0
QFN65P400X400X100-16N = smd 1.067 x 0.356: 1 -1.778,0.965; 2 -1.778,0.33; 3 -1.778,-0.33; 4 -1.778,-0.965; 9 1.778,-0.965; 10 1.778,-0.33; 11 1.778,0.33; 12 1.778,0.965 | smd 0.356 x 1.067: 5 -0.965,-1.778; 6 -0.33,-1.778; 7 0.33,-1.778; 8 0.965,-1.778; 13 0.965,1.778; 14 0.33,1.778; 15 -0.33,1.778; 16 -0.965,1.778
SOIC127P600X175-8N = smd 1.981 x 0.559: 1 -2.464,1.905; 2 -2.464,0.635; 3 -2.464,-0.635; 4 -2.464,-1.905; 5 2.464,-1.905; 6 2.464,-0.635; 7 2.464,0.635; 8 2.464,1.905
SOP65P490X110-8N = smd 1.499 x 0.432: 1 -2.184,0.965; 2 -2.184,0.33; 3 -2.184,-0.33; 4 -2.184,-0.965; 5 2.184,-0.965; 6 2.184,-0.33; 7 2.184,0.33; 8 2.184,0.965
C0603 = smd 1.1 x 1: 1 -0.85,0; 2 0.85,0
CAPC1608X90N = smd 0.83 x 0.94: 1 -0.66,0; 2 0.66,0
CAPC1608X100N = smd 0.85 x 1.02: 1 -0.69,0; 2 0.69,0
WCAP-CSGP_1206 = smd 0.9 x 1.6: 1 -1.55,0; 2 1.55,0
SMD1,27-2,54 = smd 1.27 x 2.54: 1 0,0
SOD-123 = smd 1.2 x 0.7: A 1.85,0; C -1.85,0
DIOM5126X265N = smd 2.2 x 1.55: 1 -2.05,0; 2 2.05,0
BEADC1608X95N = smd 0.9 x 1: 1 -0.8,0; 2 0.8,0
NDW0007A = smd 0.89 x 3.06: 1 -3.81,0; 2 -2.54,0; 3 -1.27,0; 4 0,0; 5 1.27,0; 6 2.54,0; 7 3.81,0 | smd 5.35 x 8.54: 8 0,7.305
SO08 = smd 0.66 x 2.032: 1 -1.905,-3.073; 2 -0.635,-3.073; 3 0.635,-3.073; 4 1.905,-3.073; 5 1.905,3.073; 6 0.635,3.073; 7 -0.635,3.073; 8 -1.905,3.073
QFP50P1200X1200X160-64N = smd 1.475 x 0.3: 1 -5.738,3.75; 2 -5.738,3.25; 3 -5.738,2.75; 4 -5.738,2.25; 5 -5.738,1.75; 6 -5.738,1.25; 7 -5.738,0.75; 8 -5.738,0.25; 9 -5.738,-0.25; 10 -5.738,-0.75; 11 -5.738,-1.25; 12 -5.738,-1.75; 13 -5.738,-2.25; 14 -5.738,-2.75; 15 -5.738,-3.25; 16 -5.738,-3.75; 33 5.738,-3.75; 34 5.738,-3.25; 35 5.738,-2.75; 36 5.738,-2.25; 37 5.738,-1.75; 38 5.738,-1.25; 39 5.738,-0.75; 40 5.738,-0.25; 41 5.738,0.25; 42 5.738,0.75; 43 5.738,1.25; 44 5.738,1.75; 45 5.738,2.25; 46 5.738,2.75; 47 5.738,3.25; 48 5.738,3.75 | smd 0.3 x 1.475: 17 -3.75,-5.738; 18 -3.25,-5.738; 19 -2.75,-5.738; 20 -2.25,-5.738; 21 -1.75,-5.738; 22 -1.25,-5.738; 23 -0.75,-5.738; 24 -0.25,-5.738; 25 0.25,-5.738; 26 0.75,-5.738; 27 1.25,-5.738; 28 1.75,-5.738; 29 2.25,-5.738; 30 2.75,-5.738; 31 3.25,-5.738; 32 3.75,-5.738; 49 3.75,5.738; 50 3.25,5.738; 51 2.75,5.738; 52 2.25,5.738; 53 1.75,5.738; 54 1.25,5.738; 55 0.75,5.738; 56 0.25,5.738; 57 -0.25,5.738; 58 -0.75,5.738; 59 -1.25,5.738; 60 -1.75,5.738; 61 -2.25,5.738; 62 -2.75,5.738; 63 -3.25,5.738; 64 -3.75,5.738
LEDC1608X90N = smd 0.7 x 0.95: 1 -0.85,0; 2 0.85,0
MOLEX_52892-1295 = smd 0.305 x 1.397: 1 2.743,2.896; 2 2.261,2.896; 3 1.753,2.896; 4 1.245,2.896; 5 0.762,2.896; 6 0.254,2.896; 7 -0.254,2.896; 8 -0.762,2.896; 9 -1.245,2.896; 10 -1.753,2.896; 11 -2.261,2.896; 12 -2.743,2.896 | smd 1.6 x 2.21: 13 -5.41,5.359; 14 5.41,5.359
53398-02 = smd 0.8 x 1.8: 1 0.625,-2.5; 2 -0.625,-2.5 | smd 2.1 x 3: S1 3.125,0.625; S2 -3.125,0.625
MS583702BA0150 = smd 1.3 x 1.3: 1 -1,1; 2 -1,-1; 3 1,-1; 4 1,1
R0603 = smd 1 x 1.1: 1 -0.85,0; 2 0.85,0
RESC1608X55N = smd 1.1 x 1: 1 -0.65,0; 2 0.65,0
SAMTEC_HTSW-120-07-L = drill 1.016 pad 1.524 square: 1 -48.26,-2.54 | drill 1.016 pad 1.524: 2 -48.26,0; 3 -45.72,-2.54; 4 -45.72,0; 5 -43.18,-2.54; 6 -43.18,0; 7 -40.64,-2.54; 8 -40.64,0; 9 -38.1,-2.54; 10 -38.1,0; 11 -35.56,-2.54; 12 -35.56,0; 13 -33.02,-2.54; 14 -33.02,0; 15 -30.48,-2.54; 16 -30.48,0; 17 -27.94,-2.54; 18 -27.94,0; 19 -25.4,-2.54; 20 -25.4,0; 21 -22.86,-2.54; 22 -22.86,0; 23 -20.32,-2.54; 24 -20.32,0; 25 -17.78,-2.54; 26 -17.78,0; 27 -15.24,-2.54; 28 -15.24,0; 29 -12.7,-2.54; 30 -12.7,0; 31 -10.16,-2.54; 32 -10.16,0; 33 -7.62,-2.54; 34 -7.62,0; 35 -5.08,-2.54; 36 -5.08,0; 37 -2.54,-2.54; 38 -2.54,0; 39 0,-2.54; 40 0,0
SOT230P700X180-4N = smd 1.9 x 0.95: 1 -3.05,2.3; 2 -3.05,0; 3 -3.05,-2.3 | smd 1.9 x 3.25: 4 3.05,0
52559-1292 = smd 0.6 x 1.5: 1 -2.75,-1.4; 2 -2.25,1.4; 3 -1.75,-1.4; 4 -1.25,1.4; 5 -0.75,-1.4; 6 -0.25,1.4; 7 0.25,-1.4; 8 0.75,1.4; 9 1.25,-1.4; 10 1.75,1.4; 11 2.25,-1.4; 12 2.75,1.4 | smd 0.8 x 1.5: M1 -3.75,-1.4; M2 3.75,-1.4; M3 3.75,1.4; M4 -3.75,1.4
50291620 = drill 1.07 pad 1.605: 1 0,0; 2 2.54,0; 3 5.08,0; 4 7.62,0; 5 10.16,0; 6 12.7,0; 7 15.24,0; 8 17.78,0
TO92- = drill 0.813 long: 1 2.54,0; 2 0,0; 3 -2.54,0

### Placement (x,y rotation side)
3V3_LS1  53.09,34.04 270 top
5V_LS1  53.85,48.51 270 top
5V_OUT_CONN  51.31,40.39 180 top
AD8426  11.43,14.99 0 top
ADA4077_TRANSIMP  19.3,12.19 90 top
ADA4077_VEXT  20.57,24.64 90 top
ADG1419  13.21,25.15 90 top
C1  14.99,9.4 180 top
C2  19.3,29.46 0 top
C3  50.55,33.27 90 top
C4  56.64,35.56 0 top
C5  56.64,33.53 0 top
C6  48.77,33.27 90 top
C7  46.99,33.27 90 top
C8  42.42,52.32 270 top
C9  44.7,47.5 90 top
C11  42.42,47.5 270 top
C12  7.87,26.67 270 top
C13  9.65,29.72 90 top
C26  45.21,33.02 270 top
C27  39.62,34.29 180 top
C28  10.16,21.34 90 top
C29  55.37,12.45 90 top
C33  22.35,33.27 270 top
C_B_OUT  36.32,33.27 270 top
C_BP1  11.94,29.72 270 top
C_BP2  22.1,19.56 180 top
C_BP3  16,29.46 180 top
C_BP4  18.54,17.02 180 top
C_BP5  11.18,18.8 0 top
C_BP6  10.67,11.94 0 top
C_BP7  14.99,11.81 0 top
C_BP8  14.22,18.54 0 top
C_BP9  16.26,25.15 90 top
C_BP10  22.86,10.41 270 top
C_BP11  7.87,23.37 90 top
C_BP12  7.37,16.76 90 top
C_CHARGE1  7.37,20.07 270 top
C_CHARGE2  4.06,12.7 180 top
CUR  7.87,9.65 180 top
D2  3.05,17.02 90 top
D3  54.86,29.21 0 top
D5  5.08,17.02 270 top
FB3  38.86,16.26 90 top
IC1  36.58,40.64 270 top
IC3  3.81,24.13 0 top
IC4  47.24,20.32 0 top
LED2  50.29,29.72 270 top
MUC_CON  49.28,14.22 180 top
POWER1  47.5,54.1 0 top
PRESSURE  4.06,33.27 0 top
R1  22.1,17.02 180 top
R2  22.86,14.22 90 top
R3  18.54,19.56 0 top
R4  16.76,21.84 270 top
R5  22.48,29.46 0 top
R6  37.85,47.5 270 top
R7  35.81,47.5 90 top
R8  56.64,31.5 180 top
R9  8.38,32.26 180 top
R10  8.38,34.04 180 top
R13  47.75,29.46 90 top
R14  10.41,25.15 90 top
R15  2.54,29.46 0 top
R16  5.84,29.46 180 top
R19  45.72,29.46 90 top
R21  20.07,33.27 270 top
R_BUCK_ON  40.13,47.5 270 top
R_CLIMIT  13.72,20.83 180 top
R_CUR_GAIN  15.24,15.24 270 top
R_CURRENT  10.67,9.4 0 top
R_FBB  42.67,33.02 270 top
R_FBT  39.62,31.75 180 top
R_RPI_PWR  36.83,27.94 180 top
R_VOL_GAIN  7.62,13.46 90 top
RPI_CONN  29.97,55.37 90 top
RPI_PWR_SWITCH  38.61,9.65 0 top
SENOR_CON  4.57,24.89 270 bottom
ST_LINK_CON1  57.4,25.91 270 top
TEMPERATURE  15.49,33.27 180 top
V+  4.83,9.65 180 top
V-  6.35,9.65 180 top
VCC_IN_CONN  38.1,50.55 270 top
VEXT  3.3,9.65 0 top

### Tracks (layer width: path | path; a pad name or v marks a point on that pad's centre or on a via)
5V_IN  (via drill 0.38)
  Top 0.305: MUC_CON.12 52.83,10.52 v52.83,9.91 | D3.2 56.9,29.19 v56.9,27.94
  Top 0.406: v35.81,6.1 35.56,6.35 RPI_PWR_SWITCH.3
  pour Power: 59.44,57.66 52.83,57.66 52.83,11.43 35.31,11.43 34.8,10.92 34.8,5.59 59.44,5.59
555_OSC
  Top 0.152: C_CHARGE1.1 7.24,20.92 6.14,19.81 5.29,19.81 5.16,19.95 5.16,20.34 IC3.3
+5V
  Top 0.152: C5.1 C4.1 55.96,35.54 3V3_LS1.1 | C5.1 57.49,32.02 R8.1 | C5.1 54.99,32.54 54.1,32.54 | 54.1,32.54 3V3_LS1.6 | D3.1 54.1,30.5 54.1,32.54
BUCK_EN
  Top 0.152: R6.2 R7.1 34.54,45.38 34.54,42.67 35.31,41.91 IC1.3
BUCK_IN
  Top 0.152: VCC_IN_CONN.1 40.22,50.55 C11.1 R_BUCK_ON.1 | R_BUCK_ON.1 R6.1 | R_BUCK_ON.1 39.12,47.33 39.12,46.23 38.61,45.72 38.61,44.96 38.1,44.45 IC1.1
BUCK_OUT  (via drill 0.38)
  Top 0.152: IC1.7 36.58,35.08 C_B_OUT.1 38.24,34.82 C27.2 | C27.2 R_FBT.2 | C27.2 38.61,34.46 v38.61,35.31
  Bottom 0.152: v38.61,35.31 43.69,40.39 5V_OUT_CONN.1
CURRENT
  Top 0.152: ADA4077_TRANSIMP.2 18.67,9.4 17.77,8.51 16.73,8.51 C1.1 15.11,8.67 13.49,8.67 12.76,9.4 R_CURRENT.2 10.74,8.62 9.22,8.62 8.19,9.65 CUR.1
CURRENT_ADC  (via drill 0.38)
  Top 0.152: AD8426.14 11.76,17.6 v11.94,17.78
  Bottom 0.152: SENOR_CON.9 5.95,23.62 5.33,23.62 4.83,23.11 4.83,19.81 5.33,19.3 10.41,19.3 v11.94,17.78
CURRENT_ADC_M  (via drill 0.38)
  Top 0.152: MUC_CON.9 50.42,11.23 50.42,10.21 49.7,9.49 46.06,9.49 42.93,12.62 42.93,19.36 42.22,20.07 IC4.9 40.38,20.07 v39.88,20.57
  Bottom 0.152: RPI_CONN.20 31.5,28.45 31.5,24.38 32,23.88 36.58,23.88 v39.88,20.57
DAC_OUT  (via drill 0.38)
  Top 0.152: ADA4077_VEXT.3 v21.21,23.75
  Bottom 0.152: SENOR_CON.11 7.58,22.64 11.68,18.54 16,18.54 v21.21,23.75
DAC_OUT_M  (via drill 0.38)
  Top 0.152: v46.48,12.7 46.36,12.7 45.82,13.25 45.55,13.25 45.11,13.68 45.11,14.46 IC4.20 44.99,17.55 45.38,17.93 45.38,18.39 45.21,18.55 v45.21,20.07 | MUC_CON.11 51.56,11.3 v51.56,9.91
  Bottom 0.152: v46.48,12.7 49.28,9.91 v51.56,9.91 | v45.21,20.07 44.41,20.87 41.87,20.87 32.77,29.97 RPI_CONN.19
GND  (via drill 0.38)
  Top 0.152: D2.C 2.54,14.66 v2.54,13.97 2.54,12.73 C_CHARGE2.2 | v11.56,10.92 11.52,10.96 C_BP6.2 | R2.1 23.39,12.85 v22.86,12.32 C_BP10.1 22.86,10.94 23.59,10.21 23.59,8.92 23.18,8.51 20.84,8.51 20.7,8.64 20.7,8.97 ADA4077_TRANSIMP.3 | C_BP2.2 21.21,19.6 v21.21,20.57 | C_BP11.2 8.93,24.22 v9.02,24.13 10.16,22.99 C28.2 | v1.91,19.56 IC3.1 | C_BP7.2 15.84,12.79 v15.88,12.83 | C_BP4.2 17.65,17.06 v17.65,18.29 | ADG1419.3 13.54,24.21 v13.59,24.26 | C_BP5.2 12.03,19.6 v11.68,19.94 | C_BP8.2 15.07,19.47 v14.99,19.56 | C_BP12.2 7.53,17.78 v8.38,17.78 | C12.2 8.85,25.82 v9.02,25.65 10.07,25.65 R14.2 | AD8426.12 13.21,16.26 v13.72,16.76 | v1.78,33.78 2.27,34.27 PRESSURE.1 | v22.35,31.24 C33.2 | R5.2 23.33,30.7 v23.37,30.73 | C_BP3.2 15.15,28.54 v15.24,28.45 16.26,27.43 C_BP9.2 | C13.2 9.74,30.48 v10.8,30.48 11.85,30.48 C_BP1.1 | v45.97,48.26 45.9,48.19 C9.2 43.96,48.19 C11.2 43.88,45.19 IC1.8 | v34.54,48.26 34.63,48.35 R7.2 | 5V_LS1.1 56.13,51.68 v56.13,53.09 | POWER1.2 46.83,51.56 v44.45,51.56 42.49,51.56 C8.2 | v34.54,40.64 IC1.4 | v57.28,36.7 57.3,36.68 C4.2 C5.2 | 3V3_LS1.2 3V3_LS1.7 52.98,33.93 C3.2 C6.2 C7.2 v46.99,35.05 | v36.32,30.48 C_B_OUT.2 | v42.67,30.99 R_FBB.2 C26.2 45.72,31.66 R19.2 45.58,29.97 v44.45,29.97 | R13.2 48.63,30.11 v48.77,29.97 49.36,30.57 LED2.1 | IC4.31 50.49,15.8 v49.78,16.51 | IC4.18 44.11,14.46 44.11,13.75 44.7,13.16 v44.7,12.7 | C29.1 55.27,11.68 v54.1,11.68 | MUC_CON.4 48.03,10.18 v48.01,10.16 48.25,10.4 48.76,10.4 49.02,10.66 49.02,10.67 | 49.02,10.67 MUC_CON.6 | MUC_CON.8 49.91,11.2 49.91,10.54 49.78,10.4 49.28,10.4 49.15,10.54 49.02,10.67 | IC4.12 41.48,18.54 v39.88,18.54
  Top 0.152: v42.8,27.3 43.56,27.3 43.99,26.87 IC4.63 | v51.56,23.37 51.76,23.57 IC4.47
  Bottom 0.152: SENOR_CON.8 3.55,24.14 | 2.52,26.14 SENOR_CON.4 | 1.78,25.14 1.78,25.15
  Bottom 0.254: 2.52,26.14 v1.78,25.4 1.78,25.15 v1.78,24.38 2.93,24.38 SENOR_CON.8 | SENOR_CON.6 1.78,25.14
  pour GND: 0,57.66 59.44,57.66 59.44,0.25 0,0.25
I2C1_SCL  (via drill 0.38)
  Top 0.152: IC4.58 46.37,25.94 46.37,25.23 46.24,25.09 45.53,25.09 43.56,23.12 v43.56,16.64
  Bottom 0.152: RPI_CONN.5 37.2,16.88 43.32,16.88 v43.56,16.64
I2C2_SCL  (via drill 0.38)
  Top 0.152: PRESSURE.3 6.33,32.27 v6.35,32.26 R9.2
  Bottom 0.152: v6.35,32.26 7.37,31.24 7.37,27.66 6.34,26.64 SENOR_CON.3
I2C2_SCL_M  (via drill 0.38)
  Top 0.152: MUC_CON.3 47.52,12.07 48.71,13.26 51.32,13.26 51.87,13.81 51.87,19.76 v51.56,20.07 52.02,20.52 52.02,20.82 52.27,21.07 IC4.42
  Bottom 0.152: v51.56,20.07 45.98,20.07 44.88,21.17 42.58,21.17 33.53,30.23 33.53,30.73 33.02,31.24 31.24,31.24 RPI_CONN.22
I2C2_SDA  (via drill 0.38)
  Top 0.152: R10.2 7.28,34.29 v6.35,34.29 5.08,34.29 PRESSURE.4
  Bottom 0.152: v6.35,34.29 4.57,32.51 4.57,28.45 3.27,27.14 SENOR_CON.2
I2C2_SDA_M  (via drill 0.38)
  Top 0.152: MUC_CON.2 47.14,11.46 47.14,12.12 48.64,13.62 51.24,13.62 51.56,13.94 51.56,19.29 51.02,19.84 51.02,20.29 51.56,20.84 v51.56,21.34 51.8,21.57 IC4.43
  Bottom 0.152: v51.56,21.34 45.14,21.34 45.01,21.48 43.04,21.48 34.04,30.48 34.04,30.99 RPI_CONN.21
INB+
  Top 0.152: ADA4077_TRANSIMP.5 21.63,15.07 R2.2 22.95,15.16 R1.1
LDO_IN
  Top 0.152: VCC_IN_CONN.3 42.39,53.01 C8.1 42.7,52.73 50.48,52.73 5V_LS1.3
LDO_OUT
  Top 0.152: 5V_LS1.2 5V_LS1.4 | C9.1 49.2,46.81 50.65,45.36 5V_LS1.4 | 5V_LS1.4 56.39,42.82 5V_OUT_CONN.3
N$1
  Top 0.152: C27.1 38.33,36.43 38.33,37.37 37.6,38.1 IC1.6 | R_FBB.1 40.89,33.87 C27.1 | R_FBT.1 C27.1
N$2
  Top 0.152: AD8426.2 9.4,15.06 9.02,15.06 8.27,14.31 R_VOL_GAIN.2
N$3
  Top 0.152: R_VOL_GAIN.1 7.62,12.62 8.89,13.89 8.89,14.29 9.02,14.43 9.42,14.43 AD8426.3
N$4
  Top 0.152: AD8426.10 14.97,14.66 R_CUR_GAIN.2
N$5
  Top 0.152: R5.1 22.48,28.61 ADA4077_VEXT.5
N$6
  Top 0.152: R_CUR_GAIN.1 13.98,16.09 13.97,16.08 13.97,15.68 13.84,15.54 13.44,15.54 AD8426.11
N$7
  Top 0.152: C2.2 21.21,28.41 ADA4077_VEXT.6 21.21,26.29 20.57,25.65 20.07,25.65 17.78,23.37 17.78,22.01 R4.2 17.69,20.07 R3.1
N$8
  Top 0.152: C33.1 R21.1 18.88,34.12 TEMPERATURE.3
N$9
  Top 0.152: IC3.7 3.39,27.42 R15.2 3.39,29.49 4.4,30.5 5.59,30.5 6.62,29.46 R16.1
N$10
  Top 0.152: IC1.5 37.17,38.77 38.2,38.77 38.64,38.34 38.64,36.58 40.16,35.05 44.45,35.05 45.21,34.29 C26.1
N$11
  Top 0.152: C12.1 7.56,27.2 IC3.5
N$16
  Top 0.152: R_CLIMIT.1 14.38,20.83 13.53,21.68 12.87,21.68 12.43,22.12 12.43,22.77 ADG1419.1
N$17
  Top 0.152: D2.A D5.C 7.02,18.87 C_CHARGE1.2
N$18
  Top 0.152: IC3.2 3.17,22.73 4.44,24 IC3.6 4.44,28.92 R16.2 5.32,29.46 6.1,28.68 9.47,28.68 C13.1
N$22
  Top 0.152: R_BUCK_ON.2 39.12,45.63 39.12,43.94 38.35,43.18 IC1.2
N$23
  Top 0.152: LED2.2 50.96,28.87 51.62,28.21 54.09,28.21 54.1,28.19 54.61,28.7 54.61,30.99 55.12,31.5 R8.2
N$24
  Top 0.152: RPI_PWR_SWITCH.1 35.56,27.52 R_RPI_PWR.2
N$25
  Top 0.152: R13.1 46.62,27.69 45.97,27.69 45.47,27.18 45.47,26.09 IC4.60
N$27
  Top 0.152: FB3.2 39.59,17.78 40.5,17.78 40.67,17.95 41.38,17.95 IC4.13
NRST  (via drill 0.38)
  Top 0.152: IC4.7 42.42,21.07 42.93,20.56 v42.93,20.32 | C29.2 55.47,13.21 ST_LINK_CON1.6
  Bottom 0.152: ST_LINK_CON1.6 55.37,13.21 49.22,19.36 44.7,19.36 44.65,19.36 43.69,20.32 v42.93,20.32
PWM_VEXT  (via drill 0.38)
  Top 0.152: ADG1419.6 13.54,28.67 v13.46,28.75
  Bottom 0.152: v13.46,28.75 11.89,27.18 8.89,27.18 6.35,24.64 SENOR_CON.7
PWM_VEXT_M  (via drill 0.38)
  Top 0.152: MUC_CON.7 49.66,11.46 49.66,12.12 50.19,12.65 51.57,12.65 54.36,15.44 54.36,22.1 53.88,22.57 IC4.45 51.78,22.57 v51.56,22.35
  Bottom 0.152: v51.56,22.35 42.93,22.35 34.54,30.73 34.54,33.02 RPI_CONN.23
RPI_5V
  Top 0.406: RPI_PWR_SWITCH.4 RPI_PWR_SWITCH.2 34.29,8.38 31.24,8.38 RPI_CONN.2
RPI_POWER
  Top 0.152: R19.1 45.72,28.45 44.99,27.72 | 44.99,27.72 IC4.61 | R_RPI_PWR.1 44.78,27.94 44.99,27.72
RPI_READY  (via drill 0.38)
  Top 0.152: IC4.56 47.37,25.94 47.37,25.23 46.63,24.48 45.97,24.48 44.5,23.01 44.5,18.75 44.83,18.41 v44.83,18.16
  Bottom 0.152: RPI_CONN.11 34.8,19.81 37.08,17.53 43.43,17.53 44.07,18.16 v44.83,18.16
RPI_SHUTOFF  (via drill 0.38)
  Top 0.152: IC4.57 46.99,25.35 46.43,24.79 45.74,24.79 44.2,23.24 v44.2,17.4
  Bottom 0.152: RPI_CONN.7 34.62,14.73 37.07,17.18 43.98,17.18 v44.2,17.4
SWO
  Top 0.152: IC4.55 48.11,25.94 48.11,25.23 48.45,24.89 53.37,24.89 54.1,24.16 54.1,23.37 55.37,22.1 55.37,20.07 57.15,18.29 ST_LINK_CON1.4
TCK
  Top 0.152: IC4.49 52.64,26.06 54.41,24.29 54.41,23.82 54.86,23.37 ST_LINK_CON1.2
TMS
  Top 0.152: IC4.46 53.89,23.07 54.86,22.1 54.86,17.02 56.13,15.75 ST_LINK_CON1.5
USART_RX  (via drill 0.38)
  Top 0.152: IC4.17 43.49,13.72 43.81,13.39 v43.81,12.7
  Bottom 0.152: v43.81,12.7 44.16,12.36 44.16,12.29 48.32,8.13 ST_LINK_CON1.8
USART_TX  (via drill 0.38)
  Top 0.152: v41.4,15.88 41.4,16.47 IC4.16
  Bottom 0.152: v41.4,15.88 44.32,15.88 49.53,10.67 ST_LINK_CON1.7
V_CURRENT
  Top 0.152: ADA4077_TRANSIMP.1 16.88,9.73 16.48,10.13 15.19,10.13 14.51,9.44 14.18,9.44 C1.2 13.19,9.4 12.41,10.18 | AD8426.9 13.21,10.97 12.8,10.56 12.7,10.46 12.41,10.18 | 12.41,10.18 10.6,10.18 R_CURRENT.1
V_VOLTAGE+
  Top 0.152: AD8426.4 8.4,12.77 8.4,12.02 8.27,11.88 7.51,11.88 6.35,10.72 V-.1
V_VOLTAGE-
  Top 0.152: AD8426.1 9.23,15.95 8.32,15.04 6.91,15.04 6.6,14.73 6.6,11.94 6.1,11.43 5.33,11.43 4.83,10.92 V+.1
VCC+  (via drill 0.38)  (1 unrouted)
  Top 0.152: ADA4077_TRANSIMP.8 17.4,15.02 C_BP4.1 19.39,18.25 v19.43,18.29 | AD8426.5 10.46,12.59 C_BP6.1 9.78,11.9 v9.78,10.92 | 10.16,16.76 8.22,16.76 C_BP12.1 8.34,15.91 v8.38,15.88 | 10.16,16.76 AD8426.16 | IC3.8 1.91,29.25 R15.1 1.52,29.46 1.12,29.06 v1.12,28.37 | IC3.4 7.18,22.52 C_BP11.1 7.91,22.48 v9.02,22.48 | ADA4077_VEXT.8 18.67,27.65 C_BP3.1 16.89,29.42 v16.89,28.45 | ADG1419.4 15.51,24.3 C_BP9.1 17.36,25.4 v17.53,25.4 | C_BP5.1 10.33,16.93 10.16,16.76 | POWER1.1 48.12,51.23 46.93,50.04 42.16,50.04 39.12,53.09 VCC_IN_CONN.2 33.78,48.77 33.78,41.4 RPI_CONN.27 31.24,38.86 31.24,26.16 RPI_CONN.16
  Bottom 0.152: 2.54,22.1 3.13,22.1 SENOR_CON.12
  Bottom 0.254: v1.78,22.86 2.54,22.1
  pour Power: 0.51,29.72 0.51,7.37 24.38,7.37 24.64,7.62 24.64,29.72
VCC-  (via drill 0.38)
  Top 0.152: C_BP10.2 21.37,9.56 ADA4077_TRANSIMP.4 20.7,10.24 v20.7,11.56 20.45,11.81 17.21,11.81 16.48,11.08 15.19,11.08 14.46,11.81 C_BP7.1 14.14,12.74 v14.22,12.83 | D5.A 5.08,13.23 C_CHARGE2.1 5.84,12.93 v5.84,13.97 | ADA4077_VEXT.4 22.95,21.7 22.95,19.81 | 22.95,19.81 C_BP2.1 | v22.86,18.54 22.86,19.72 22.95,19.81 | AD8426.8 12.39,14.02 v11.94,14.48 11.94,14.73 12.39,15.19 AD8426.13 13.37,17.74 C_BP8.1 13.34,18.58 v13.34,19.56 | v13.21,25.91 12.88,26.24 ADG1419.7 12.88,28.44 12.45,28.87 C_BP1.2
  Bottom 0.152: v22.86,18.54 20.7,16.38 v20.7,11.56 | v14.22,12.83 12.57,14.48 v11.94,14.48 11.94,14.22 11.18,13.46 6.35,13.46 v5.84,13.97 | v13.21,25.91 12.7,25.4 12.7,20.19 v13.34,19.56
VDD  (via drill 0.38)  (1 unrouted)
  Top 0.152: R10.1 R9.1 v10.41,32.26 | v1.78,32.26 1.79,32.27 PRESSURE.2 | R21.2 20.07,31.5 v20.32,31.24 | v21.21,18.29 21.25,18.25 R1.2 | v46.99,31.5 C7.1 C6.1 C3.1 50.62,32.54 3V3_LS1.4 51.56,31.96 v51.56,31.5 | v40,15.49 39.97,15.46 FB3.1 | IC4.19 44.61,14.46 44.61,13.75 45.59,12.77 v45.59,12.7 46.53,11.76 MUC_CON.1 | IC4.64 43.47,26.04 v42.8,26.04 42.8,25.36 IC4.1 | v50.93,16.38 50.99,16.32 IC4.32 | IC4.48 51.75,24.07 v51.56,24.26
  Bottom 0.152: v20.32,31.24 22.1,29.46 22.1,19.18 v21.21,18.29 | RPI_CONN.25 35.56,34.54 35.56,30.15 39.71,26 42.76,26 v42.8,26.04 | v51.56,31.5 51.56,28.45 54.1,25.91 ST_LINK_CON1.1
  Bottom 0.254: SENOR_CON.1 5.38,27.64 5.33,27.69 5.33,27.73 4.94,28.13 4.94,29.16 5.33,29.55 v5.33,31.11 v6.22,31.11
  pour Power: 0.51,35.56 0.51,30.23 24.13,30.23 24.13,35.56
  pour Power: 52.32,57.91 52.32,11.94 34.8,11.94 34.29,11.43 34.29,5.33 28.7,5.33 28.7,57.91
VEXT  (via drill 0.38)
  Top 0.152: C28.1 10.5,20.83 R_CLIMIT.2 | R14.1 10.41,23.3 10.89,22.83 10.89,21.21 C28.1 | C28.1 9.4,19.72 v9.4,17.78 | VEXT.1 3.3,9.91 2.03,11.18 v1.78,11.18
  Bottom 0.152: v9.4,17.78 9.34,17.78 8.79,17.23 8.08,17.23 2.02,11.18 v1.78,11.18
VEXT+  (via drill 0.38)
  Top 0.152: R3.2 19.39,21.59 | 19.39,21.59 19.39,21.63 ADA4077_VEXT.2 | 19.39,21.59 18.81,22.17 ADA4077_VEXT.1 18.67,22.99 v19.3,23.62 | v12.19,25.91 12.19,27.28 ADG1419.8
  Bottom 0.152: v12.19,25.91 12.44,25.91 12.98,26.45 14.95,26.45 17.78,23.62 v19.3,23.62
VEXT-
  Top 0.152: C2.1 19.94,27.98 ADA4077_VEXT.7 19.94,26.29 16.76,23.11 R4.1 15.19,22.69 14.48,21.98 13.23,21.98 13.09,22.12 13.09,22.75 ADG1419.2
VOLTAGE_ADC  (via drill 0.38)
  Top 0.152: AD8426.15 11.1,17.6 v10.92,17.78
  Bottom 0.152: SENOR_CON.10 3.78,23.14 4.32,22.61 4.32,19.56 5.08,18.8 10.16,18.8 10.92,18.03 v10.92,17.78
VOLTAGE_ADC_M  (via drill 0.38)
  Top 0.152: MUC_CON.10 51.03,10.39 49.78,9.14 45.97,9.14 42.62,12.5 42.62,19.17 42.34,19.45 41.63,19.45 IC4.10 39.89,19.57 v39.88,19.56
  Bottom 0.152: RPI_CONN.18 31.19,26.21 31.19,24.26 31.88,23.57 35.86,23.57 v39.88,19.56
VREF  (via drill 0.38)
  Top 0.152: AD8426.7 AD8426.6 10.92,13.39 v10.92,14.48 | ADA4077_TRANSIMP.6 ADA4077_TRANSIMP.7 19.3,15.29 v19.3,16
  Bottom 0.152: v19.3,16 12.45,16 v10.92,14.48
ZAC_WIRE
  Bottom 0.152: TEMPERATURE.2 13.72,31.5 8.38,31.5 8.13,31.24 8.13,27.18 6.59,25.64 SENOR_CON.5
ZAC_WIRE_M  (via drill 0.38)
  Top 0.152: IC4.37 53.1,18.45 53.81,18.45 53.95,18.32 53.95,15.46 52.9,14.41 | 52.9,14.41 51.44,12.96 49.02,12.96 48.51,12.45 MUC_CON.5 | 52.9,14.41 52.9,14.67 v52.58,14.99
  Bottom 0.152: v52.58,14.99 51.82,15.75 51.82,16.33 49.1,19.05 42.93,19.05 34.54,27.43 RPI_CONN.17

### Text on the board
bNames: MICRO CTD MCU BOARD V0.2 / JUNSU J & CHARLENE X / FUTURE OCEAN LAB 6/7/19 | PINOUT | ---- | GND ----> / GND / GND / SCL / C_ADC / V_ADC / VCC+ | VCC+ / VDD / PWM / SDA / DAC / TSIC / GND | PINOUT | VDD / SCL / TSIC / PWM / C_ADC / DAC | SDA / GND / GND / GND / V_ADC / VCC+ | PINOUT | MICRO CTD SENSOR BOARD V0.2 / JUNSU J & CHARLENE X / FUTURE OCEAN LAB 6/6/19 | |O / |O / |O / |GND / |O / |RPI_5V ----> | RPI_READY / O / RPI_SHUT / RPI_SCL / RPI_SDA / O